# Altium project QUTMS_Shutdownboard_V2_1.PrjPcb (part 1 of 2)
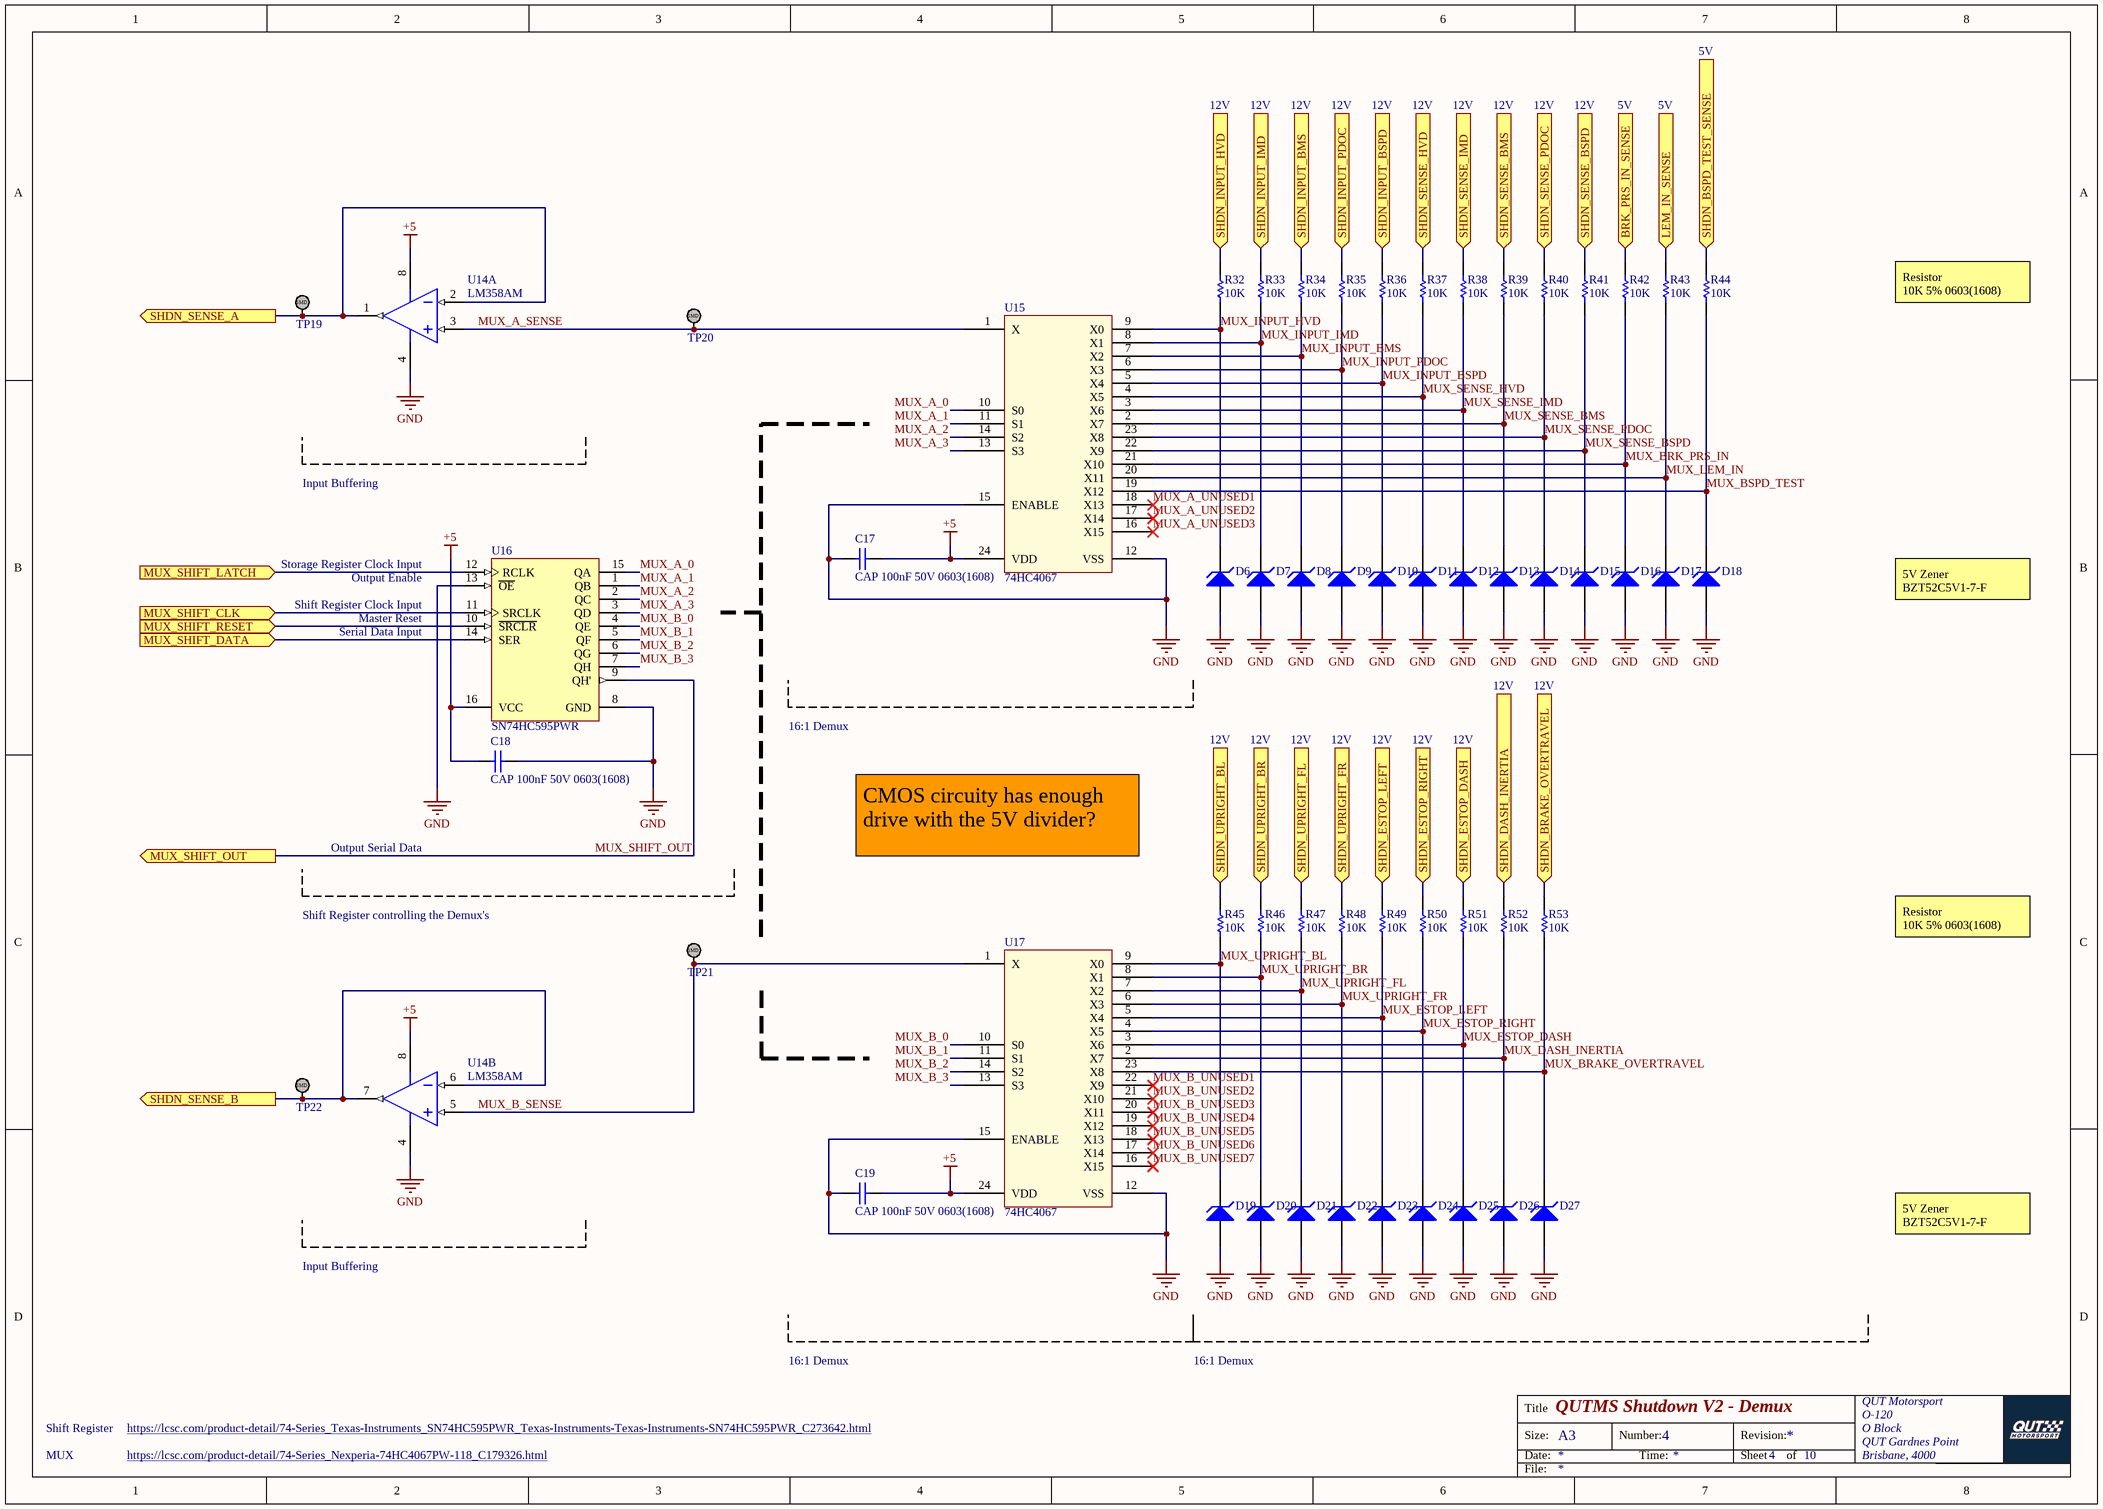
[diagram p0: Demux.SchDoc]
8 sheets, 180 parts. Net scope: hierarchical (ports join the sheet entries above them; power ports are global).
Sheets:
  Demux.SchDoc
  Master.SchDoc
    Connector = Connector.SchDoc
    SHDN_LOOP = ShutdownLoop.SchDoc
      SHDN_SEG1 = ShutdownSegement.SchDoc
      SHDN_SEG2 = ShutdownSegement.SchDoc
      SHDN_SEG3 = ShutdownSegement.SchDoc
      SHDN_SEG4 = ShutdownSegement.SchDoc
      SHDN_SEG5 = ShutdownSegement.SchDoc
      SHDN_SEG6 = ShutdownSegement.SchDoc
    MCU = MCU.SchDoc
    PWR = Power.SchDoc
    SHDN_RESET_PROTECTION = 12VInputProtection.SchDoc
    SHDN_RESET_PROTECTION = 12VInputProtection.SchDoc
    SHDN_RESET_PROTECTION = 12VInputProtection.SchDoc
    SHDN_RESET_PROTECTION = 12VInputProtection.SchDoc
    SHDN_RESET_PROTECTION = 12VInputProtection.SchDoc
    SHDN_RESET_PROTECTION = 12VInputProtection.SchDoc

## Sheet Demux.SchDoc: QUTMS Shutdown V2 - Demux
size A3; Organization: QUT Motorsport; Address1: O-120; Address2: O Block; Address3: QUT Gardnes Point; Address4: Brisbane, 4000; DocumentNumber: 4; SheetNumber: 4; SheetTotal: 10

### Parts
C17  CAP 100nF 50V 0603(1608)  [CAPC0603(1608)100_L]
C18  CAP 100nF 50V 0603(1608)  [CAPC0603(1608)100_L]
C19  CAP 100nF 50V 0603(1608)  [CAPC0603(1608)100_L]
D6  BZT52C5V1-7-F  [DIOD-SOD123_V]  (value not drawn)
D7  BZT52C5V1-7-F  [DIOD-SOD123_V]  (value not drawn)
D8  BZT52C5V1-7-F  [DIOD-SOD123_V]  (value not drawn)
D9  BZT52C5V1-7-F  [DIOD-SOD123_V]  (value not drawn)
D10  BZT52C5V1-7-F  [DIOD-SOD123_V]  (value not drawn)
D11  BZT52C5V1-7-F  [DIOD-SOD123_V]  (value not drawn)
D12  BZT52C5V1-7-F  [DIOD-SOD123_V]  (value not drawn)
D13  BZT52C5V1-7-F  [DIOD-SOD123_V]  (value not drawn)
D14  BZT52C5V1-7-F  [DIOD-SOD123_V]  (value not drawn)
D15  BZT52C5V1-7-F  [DIOD-SOD123_V]  (value not drawn)
D16  BZT52C5V1-7-F  [DIOD-SOD123_V]  (value not drawn)
D17  BZT52C5V1-7-F  [DIOD-SOD123_V]  (value not drawn)
D18  BZT52C5V1-7-F  [DIOD-SOD123_V]  (value not drawn)
D19  BZT52C5V1-7-F  [DIOD-SOD123_V]  (value not drawn)
D20  BZT52C5V1-7-F  [DIOD-SOD123_V]  (value not drawn)
D21  BZT52C5V1-7-F  [DIOD-SOD123_V]  (value not drawn)
D22  BZT52C5V1-7-F  [DIOD-SOD123_V]  (value not drawn)
D23  BZT52C5V1-7-F  [DIOD-SOD123_V]  (value not drawn)
D24  BZT52C5V1-7-F  [DIOD-SOD123_V]  (value not drawn)
D25  BZT52C5V1-7-F  [DIOD-SOD123_V]  (value not drawn)
D26  BZT52C5V1-7-F  [DIOD-SOD123_V]  (value not drawn)
D27  BZT52C5V1-7-F  [DIOD-SOD123_V]  (value not drawn)
R32  10K  [RESC0603(1608)_N]
R33  10K  [RESC0603(1608)_N]
R34  10K  [RESC0603(1608)_N]
R35  10K  [RESC0603(1608)_N]
R36  10K  [RESC0603(1608)_N]
R37  10K  [RESC0603(1608)_N]
R38  10K  [RESC0603(1608)_N]
R39  10K  [RESC0603(1608)_N]
R40  10K  [RESC0603(1608)_N]
R41  10K  [RESC0603(1608)_N]
R42  10K  [RESC0603(1608)_N]
R43  10K  [RESC0603(1608)_N]
R44  10K  [RESC0603(1608)_N]
R45  10K  [RESC0603(1608)_N]
R46  10K  [RESC0603(1608)_N]
R47  10K  [RESC0603(1608)_N]
R48  10K  [RESC0603(1608)_N]
R49  10K  [RESC0603(1608)_N]
R50  10K  [RESC0603(1608)_N]
R51  10K  [RESC0603(1608)_N]
R52  10K  [RESC0603(1608)_N]
R53  10K  [RESC0603(1608)_N]
TP19  TestPoint_SMD  [TestPointSMD]  (value not drawn)
TP20  TestPoint_SMD  [TestPointSMD]  (value not drawn)
TP21  TestPoint_SMD  [TestPointSMD]  (value not drawn)
TP22  TestPoint_SMD  [TestPointSMD]  (value not drawn)
U14  LM358AM  [D0008A_M]  (parts A,B of 2)
U15  74HC4067  [74HC4067 TSSOP24]
U16  SN74HC595PWR  [PW0016A_L]
U17  74HC4067  [74HC4067 TSSOP24]

### Ports
BRK_PRS_IN_SENSE (in), LEM_IN_SENSE (in), MUX_SHIFT_CLK (in), MUX_SHIFT_DATA (in), MUX_SHIFT_LATCH (in), MUX_SHIFT_OUT (out), MUX_SHIFT_RESET (in), SHDN_BRAKE_OVERTRAVEL (in), SHDN_BSPD_TEST_SENSE (in), SHDN_DASH_INERTIA (in), SHDN_ESTOP_DASH (in), SHDN_ESTOP_LEFT (in), SHDN_ESTOP_RIGHT (in), SHDN_INPUT_BMS (in), SHDN_INPUT_BSPD (in), SHDN_INPUT_HVD (in), SHDN_INPUT_IMD (in), SHDN_INPUT_PDOC (in), SHDN_SENSE_A (out), SHDN_SENSE_B (out), SHDN_SENSE_BMS (in), SHDN_SENSE_BSPD (in), SHDN_SENSE_HVD (in), SHDN_SENSE_IMD (in), SHDN_SENSE_PDOC (in), SHDN_UPRIGHT_BL (in), SHDN_UPRIGHT_BR (in), SHDN_UPRIGHT_FL (in), SHDN_UPRIGHT_FR (in)

### Nets
+5: C17.1 C18.2 C19.1 U14.8(V+) U15.24(VDD) U16.16(VCC) U17.24(VDD)
GND: C17.2 C18.1 C19.2 D6.1(A) D7.1(A) D8.1(A) D9.1(A) D10.1(A) D11.1(A) D12.1(A) D13.1(A) D14.1(A) D15.1(A) D16.1(A) D17.1(A) D18.1(A) D19.1(A) D20.1(A) D21.1(A) D22.1(A) D23.1(A) D24.1(A) D25.1(A) D26.1(A) D27.1(A) U14.4(GND) U15.12(VSS) U15.15(ENABLE) U16.8(GND) U16.13(~{OE}) U17.12(VSS) U17.15(ENABLE)
MUX_A_0: U15.10(S0) U16.15(QA)
MUX_A_1: U15.11(S1) U16.1(QB)
MUX_A_2: U15.14(S2) U16.2(QC)
MUX_A_3: U15.13(S3) U16.3(QD)
MUX_A_SENSE: TP20.1 U14.3(INA+) U15.1(X)
MUX_A_UNUSED1: U15.18(X13)
MUX_A_UNUSED2: U15.17(X14)
MUX_A_UNUSED3: U15.16(X15)
MUX_B_0: U16.4(QE) U17.10(S0)
MUX_B_1: U16.5(QF) U17.11(S1)
MUX_B_2: U16.6(QG) U17.14(S2)
MUX_B_3: U16.7(QH) U17.13(S3)
MUX_B_SENSE: TP21.1 U14.5(INB+) U17.1(X)
MUX_B_UNUSED1: U17.22(X9)
MUX_B_UNUSED2: U17.21(X10)
MUX_B_UNUSED3: U17.20(X11)
MUX_B_UNUSED4: U17.19(X12)
MUX_B_UNUSED5: U17.18(X13)
MUX_B_UNUSED6: U17.17(X14)
MUX_B_UNUSED7: U17.16(X15)
MUX_BRAKE_OVERTRAVEL: D27.2(K) R53.2 U17.23(X8)
MUX_BRK_PRS_IN: D16.2(K) R42.2 U15.21(X10)
MUX_BSPD_TEST: D18.2(K) R44.2 U15.19(X12)
MUX_DASH_INERTIA: D26.2(K) R52.2 U17.2(X7)
MUX_ESTOP_DASH: D25.2(K) R51.2 U17.3(X6)
MUX_ESTOP_LEFT: D23.2(K) R49.2 U17.5(X4)
MUX_ESTOP_RIGHT: D24.2(K) R50.2 U17.4(X5)
MUX_INPUT_BMS: D8.2(K) R34.2 U15.7(X2)
MUX_INPUT_BSPD: D10.2(K) R36.2 U15.5(X4)
MUX_INPUT_HVD: D6.2(K) R32.2 U15.9(X0)
MUX_INPUT_IMD: D7.2(K) R33.2 U15.8(X1)
MUX_INPUT_PDOC: D9.2(K) R35.2 U15.6(X3)
MUX_LEM_IN: D17.2(K) R43.2 U15.20(X11)
MUX_SENSE_BMS: D13.2(K) R39.2 U15.2(X7)
MUX_SENSE_BSPD: D15.2(K) R41.2 U15.22(X9)
MUX_SENSE_HVD: D11.2(K) R37.2 U15.4(X5)
MUX_SENSE_IMD: D12.2(K) R38.2 U15.3(X6)
MUX_SENSE_PDOC: D14.2(K) R40.2 U15.23(X8)
MUX_SHIFT_OUT: U16.9(QH') ; port MUX_SHIFT_OUT
MUX_UPRIGHT_BL: D19.2(K) R45.2 U17.9(X0)
MUX_UPRIGHT_BR: D20.2(K) R46.2 U17.8(X1)
MUX_UPRIGHT_FL: D21.2(K) R47.2 U17.7(X2)
MUX_UPRIGHT_FR: D22.2(K) R48.2 U17.6(X3)
NetR32_1: R32.1 ; port SHDN_INPUT_HVD
NetR33_1: R33.1 ; port SHDN_INPUT_IMD
NetR34_1: R34.1 ; port SHDN_INPUT_BMS
NetR35_1: R35.1 ; port SHDN_INPUT_PDOC
NetR36_1: R36.1 ; port SHDN_INPUT_BSPD
NetR37_1: R37.1 ; port SHDN_SENSE_HVD
NetR38_1: R38.1 ; port SHDN_SENSE_IMD
NetR39_1: R39.1 ; port SHDN_SENSE_BMS
NetR40_1: R40.1 ; port SHDN_SENSE_PDOC
NetR41_1: R41.1 ; port SHDN_SENSE_BSPD
NetR42_1: R42.1 ; port BRK_PRS_IN_SENSE
NetR43_1: R43.1 ; port LEM_IN_SENSE
NetR44_1: R44.1 ; port SHDN_BSPD_TEST_SENSE
NetR45_1: R45.1 ; port SHDN_UPRIGHT_BL
NetR46_1: R46.1 ; port SHDN_UPRIGHT_BR
NetR47_1: R47.1 ; port SHDN_UPRIGHT_FL
NetR48_1: R48.1 ; port SHDN_UPRIGHT_FR
NetR49_1: R49.1 ; port SHDN_ESTOP_LEFT
NetR50_1: R50.1 ; port SHDN_ESTOP_RIGHT
NetR51_1: R51.1 ; port SHDN_ESTOP_DASH
NetR52_1: R52.1 ; port SHDN_DASH_INERTIA
NetR53_1: R53.1 ; port SHDN_BRAKE_OVERTRAVEL
NetTP19_1: TP19.1 U14.1(OUTA) U14.2(INA-) ; port SHDN_SENSE_A
NetTP22_1: TP22.1 U14.6(INB-) U14.7(OUTB) ; port SHDN_SENSE_B
NetU16_10: U16.10(~{SRCLR}) ; port MUX_SHIFT_RESET
NetU16_11: U16.11(SRCLK) ; port MUX_SHIFT_CLK
NetU16_12: U16.12(RCLK) ; port MUX_SHIFT_LATCH
NetU16_14: U16.14(SER) ; port MUX_SHIFT_DATA

### Notes on the sheet
- 12V
- 5V
- Resistor
  10K 5% 0603(1608)
- Input Buffering
- Output Enable
- Storage Register Clock Input
- Serial Data Input
- Master Reset
- Shift Register Clock Input
- 5V Zener
  BZT52C5V1-7-F
- 16:1 Demux
- Output Serial Data
- CMOS circuity has enough drive with the 5V divider?
- Shift Register controlling the Demux's
- MUX
- Shift Register
- https://lcsc.com/product-detail/74-Series_Nexperia-74HC4067PW-118_C179326.html
- https://lcsc.com/product-detail/74-Series_Texas-Instruments_SN74HC595PWR_Texas-Instruments-Texas-Instruments-SN74HC595PWR_C273642.html
- Title
- Size:
- Date:
- A3
- Number:
- Time:
- Revision:
- Sheet
- of
- File:
- (in symbol TestPoint_SMD) SMD

### Library data of the parts
C17-C19 = CMP-1035-02591-1: CAP 100nF 50V ±5% 0603 (1608 Metric) Thickness 1mm SMD; Tolerance: Â±5%; Case-Metric: 1608; Case-EIA: 0603; Rated Voltage: 50 V; Max Thickness: 1 mm; Technology: SMT; Value: 100nF
D6-D27 = CMP-2000-05976-1: Surface Mount Zener Diode, 5.1 V, -65 to 150 degC, 2-Pin SMD (SOD-123), RoHS, Tape and Reel; Manufacturer: DiodesIncorporated; Unit Weight: 0.000353oz; Zz - Zener Impedance: 60Ohms; Vz - Zener Voltage: 5.1V; Pd - Power Dissipation: 500mW; Zener Current: 5mA; Ir - Reverse Current: 2uA; Voltage Temperature Coefficient: -0.75mV/C; Configuration: Single; Voltage Tolerance: 6%; Height: 1.35mm; Width: 1.7mm; Minimum Operating Temperature: -65C; Series: BZT52C5; Package Description: 2-Pin Surface Mount Device, Body 2.7 x 1.55 mm; Length: 2.85mm; Mounting Technology: SurfaceMount; Brand: DiodesIncorporated; Factory Pack Quantity: 3000; Product Category: ZenerDiodes; RoHS: True; Manufacturer URL: http://www.diodes.com/; Termination Style: SMD/SMT; Package / Case: SOD-123; Packaging: Reel; Package Reference: SOD123; Datasheet Version: Rev. 37-2, 09/2012; Maximum Operating Temperature: +150C; Datasheet URL: http://www.diodes.com/_files/datasheets/ds18004.pdf; Mounting Style: SMD/SMT
R32-R53 = CMP-1012-00098-1: 10K 0.1W 5% 0603 (1608 Metric)  SMD; Case-EIA: 0603; Value: 10000.00 Ohm; Case-Metric: 1608; Technology: SMT; Tolerance: 5 %; Power: 0.1 W
U14 = CMP-0055-00796-3: Low Power Dual Operational Amplifier, 8-pin Narrow SOIC; Manufacturer: Texas Instruments; CompType: Amplifiers; PackageTopMarking: NSZXTT*LM*358AM; PowerWise: N; Code_JEDEC: MS-012-AA; RoHS: N; PinCount: 8; Package Reference: D0008A; ComponentLink1Description: Datasheet URL; ComponentLink1URL: http://www.ti.com/general/docs/lit/getliterature.tsp?genericPartNumber=LM358-N&fileType=pdf; Code_IPC: SOIC127P600-8; PackageDescription: SOIC Narrow, 4.9 x 3.9 x 1.45mm, 8 Lead, 1.27mm Pitch
U16 = CMP-0780-00192-3: 8-Bit Shift Registers With 3-State Output Registers, PW0016A, LARGE T&R; Manufacturer: Texas Instruments; VCC(Max)(V): 6; Bits: 8; Output Type: CMOS; 3-State Output: Yes; Output Drive (IOL/IOH)(Max)(mA): 7.8/-7.8; VCC(Min)(V): 2; Rating: Military; tpd @ Nom Voltage(Max)(ns): 34; ICC @ Nom Voltage(Max)(mA): 0.08; Technology Family: HC; F @ Nom Voltage(Max)(Mhz): 28; PackageReference: PW0016A; Generic Part Number: SN74HC595; Operating Temperature Range(C): -40 to 85; PackageVersion: http://www.ti.com/lit/ml/mpds361/mpds361.pdf; Code_JEDEC: MO-153; DatasheetVersion: SCLS041H; Voltage(Nom)(V): 6; Input Type: CMOS

## Sheet Master.SchDoc
size A3
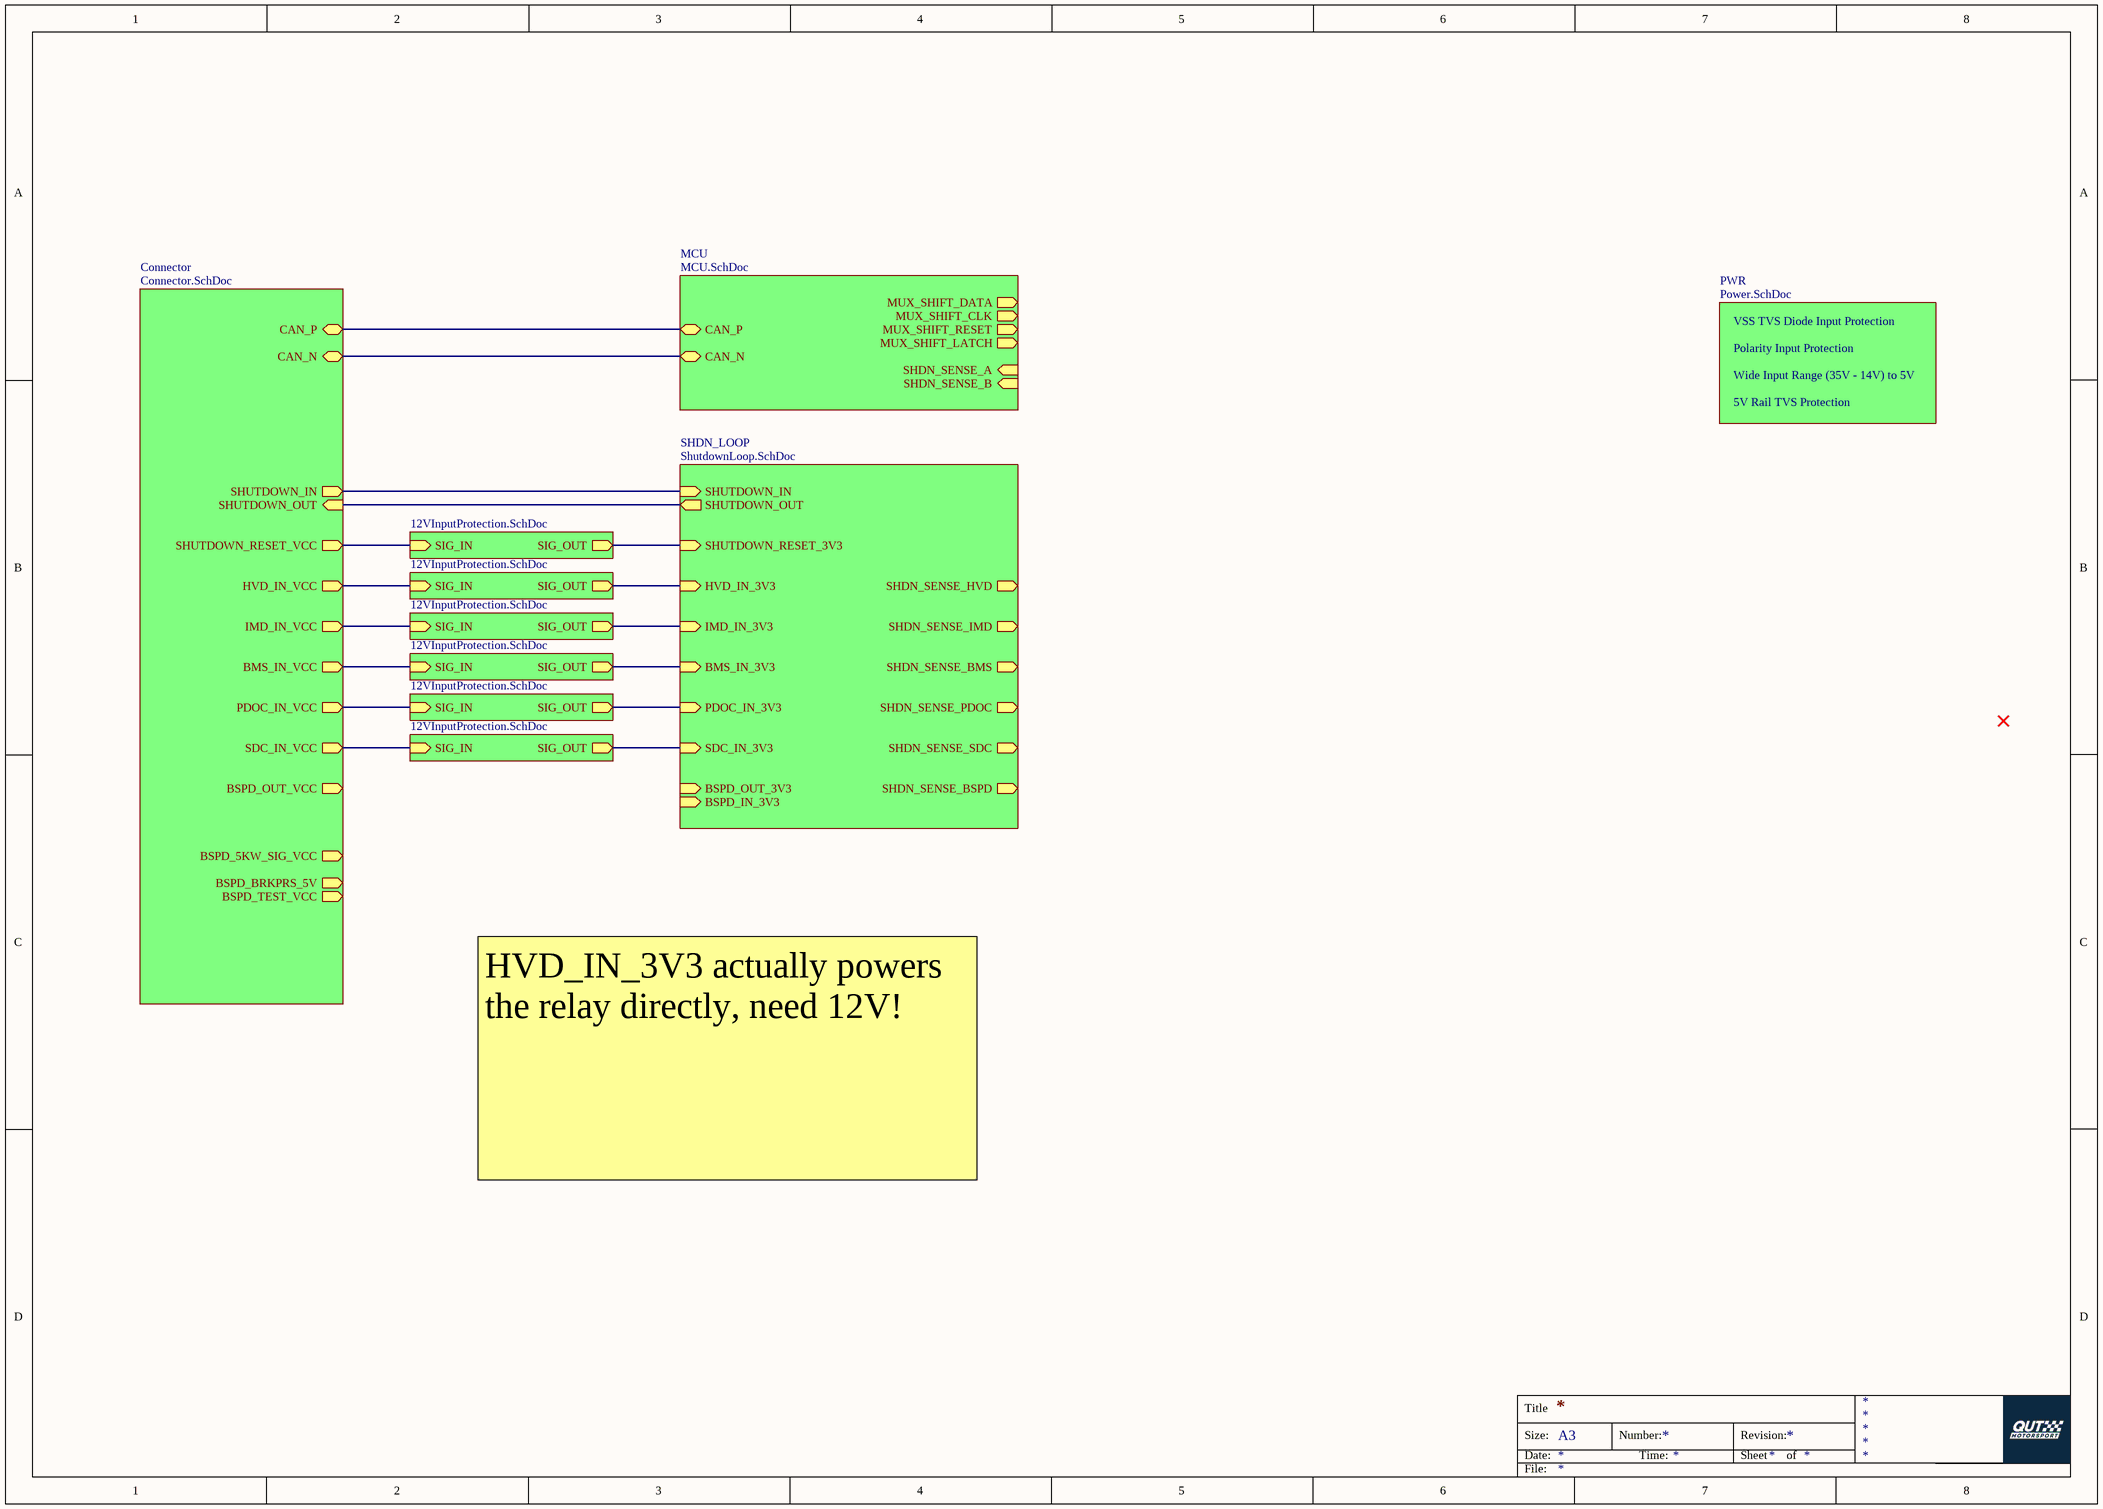
[diagram p1: Master.SchDoc]

### Sub-sheets
Connector = Connector.SchDoc: CAN_N (bidir), CAN_P (bidir), SHUTDOWN_IN (out), SHUTDOWN_OUT (in), HVD_IN_VCC (out), BMS_IN_VCC (out), SHUTDOWN_RESET_VCC (out), SDC_IN_VCC (out), BSPD_OUT_VCC (out), BSPD_BRKPRS_5V (out), PDOC_IN_VCC (out), BSPD_TEST_VCC (out), IMD_IN_VCC (out), BSPD_5KW_SIG_VCC (out)
MCU = MCU.SchDoc: SHDN_SENSE_B (in), SHDN_SENSE_A (in), MUX_SHIFT_LATCH (out), MUX_SHIFT_RESET (out), MUX_SHIFT_CLK (out), MUX_SHIFT_DATA (out), CAN_P (bidir), CAN_N (bidir)
PWR = Power.SchDoc: no entries
SHDN_LOOP = ShutdownLoop.SchDoc: SHDN_SENSE_BSPD (out), SHDN_SENSE_PDOC (out), SHDN_SENSE_BMS (out), SHDN_SENSE_IMD (out), SHUTDOWN_OUT (out), SHUTDOWN_IN (in), SHDN_SENSE_HVD (out), SHDN_SENSE_SDC (out), BSPD_IN_3V3 (in), SDC_IN_3V3 (in), SHUTDOWN_RESET_3V3 (in), BMS_IN_3V3 (in), IMD_IN_3V3 (in), PDOC_IN_3V3 (in), HVD_IN_3V3 (in), BSPD_OUT_3V3 (in)
SHDN_RESET_PROTECTION = 12VInputProtection.SchDoc: SIG_OUT (out), SIG_IN (in)
SHDN_RESET_PROTECTION = 12VInputProtection.SchDoc: SIG_OUT (out), SIG_IN (in)
SHDN_RESET_PROTECTION = 12VInputProtection.SchDoc: SIG_OUT (out), SIG_IN (in)
SHDN_RESET_PROTECTION = 12VInputProtection.SchDoc: SIG_OUT (out), SIG_IN (in)
SHDN_RESET_PROTECTION = 12VInputProtection.SchDoc: SIG_OUT (out), SIG_IN (in)
SHDN_RESET_PROTECTION = 12VInputProtection.SchDoc: SIG_OUT (out), SIG_IN (in)

### Nets
BMS_IN_VCC: sheet Connector/BMS_IN_VCC, sheet SHDN_RESET_PROTECTION/SIG_IN
CAN_N: sheet Connector/CAN_N, sheet MCU/CAN_N
CAN_P: sheet Connector/CAN_P, sheet MCU/CAN_P
HVD_IN_VCC: sheet Connector/HVD_IN_VCC, sheet SHDN_RESET_PROTECTION/SIG_IN
IMD_IN_VCC: sheet Connector/IMD_IN_VCC, sheet SHDN_RESET_PROTECTION/SIG_IN
PDOC_IN_VCC: sheet Connector/PDOC_IN_VCC, sheet SHDN_RESET_PROTECTION/SIG_IN
SDC_IN_VCC: sheet Connector/SDC_IN_VCC, sheet SHDN_RESET_PROTECTION/SIG_IN
SHDN_IN1: sheet Connector/SHUTDOWN_IN, sheet SHDN_LOOP/SHUTDOWN_IN
SHDN_OUT6: sheet Connector/SHUTDOWN_OUT, sheet SHDN_LOOP/SHUTDOWN_OUT
SHDN_SEG_LATCH: sheet SHDN_LOOP/SHUTDOWN_RESET_3V3, sheet SHDN_RESET_PROTECTION/SIG_OUT
SHUTDOWN_RESET: sheet Connector/SHUTDOWN_RESET_VCC, sheet SHDN_RESET_PROTECTION/SIG_IN
STATE_TRIGGER1: sheet SHDN_LOOP/HVD_IN_3V3, sheet SHDN_RESET_PROTECTION/SIG_OUT
STATE_TRIGGER2: sheet SHDN_LOOP/IMD_IN_3V3, sheet SHDN_RESET_PROTECTION/SIG_OUT
STATE_TRIGGER3: sheet SHDN_LOOP/BMS_IN_3V3, sheet SHDN_RESET_PROTECTION/SIG_OUT
STATE_TRIGGER4: sheet SHDN_LOOP/PDOC_IN_3V3, sheet SHDN_RESET_PROTECTION/SIG_OUT
STATE_TRIGGER6: sheet SHDN_LOOP/SDC_IN_3V3, sheet SHDN_RESET_PROTECTION/SIG_OUT

### Notes on the sheet
- VSS TVS Diode Input Protection
- Polarity Input Protection
- Wide Input Range (35V - 14V) to 5V
- 5V Rail TVS Protection
- HVD_IN_3V3 actually powers the relay directly, need 12V!
- Title
- Size:
- Date:
- A3
- Number:
- Time:
- Revision:
- Sheet
- of
- File:

## Sheet Connector.SchDoc: QUTMS Shutdown V2 - Connector
size A4; Organization: QUT Motorsport; Address1: O-120; Address2: O Block; Address3: QUT Gardens Point; Address4: Brisbane, 4000; DocumentNumber: 3; SheetNumber: 3; SheetTotal: 10
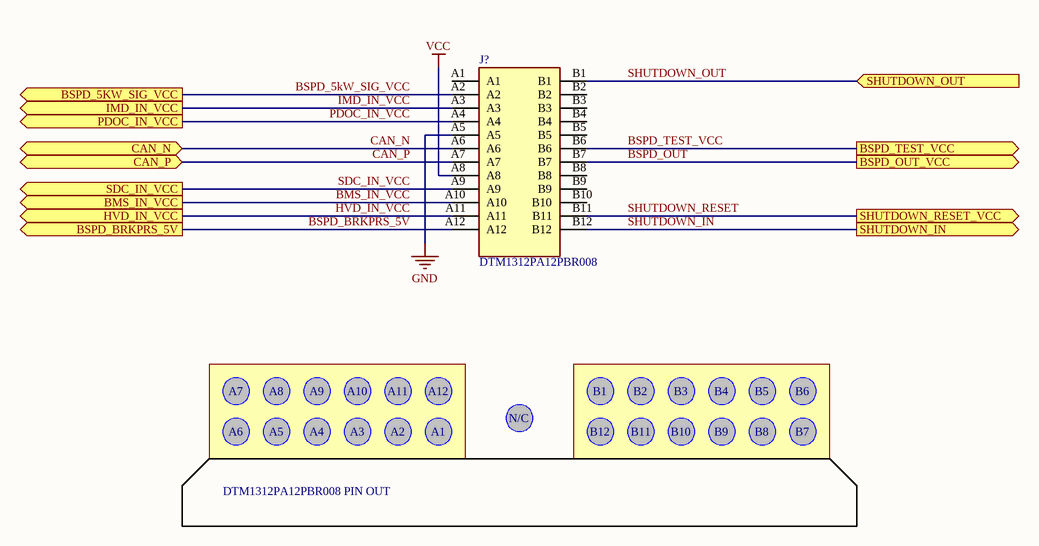
[diagram p2: Connector.SchDoc]

### Parts
J?  DTM1312PA12PBR008  [TE_DTM1312PA12PBR008]

### Ports
BMS_IN_VCC (out), BSPD_5KW_SIG_VCC (out), BSPD_BRKPRS_5V (out), BSPD_OUT_VCC (out), BSPD_TEST_VCC (out), CAN_N (bidir), CAN_P (bidir), HVD_IN_VCC (out), IMD_IN_VCC (out), PDOC_IN_VCC (out), SDC_IN_VCC (out), SHUTDOWN_IN (out), SHUTDOWN_OUT (in), SHUTDOWN_RESET_VCC (out)

### Nets
GND: J?.A5
VCC: J?.A8
BMS_IN_VCC: J?.A10 ; port BMS_IN_VCC
BSPD_5kW_SIG_VCC: J?.A2 ; port BSPD_5KW_SIG_VCC
BSPD_BRKPRS_5V: J?.A12 ; port BSPD_BRKPRS_5V
BSPD_OUT: J?.B7 ; port BSPD_OUT_VCC
BSPD_TEST_VCC: J?.B6 ; port BSPD_TEST_VCC
CAN_N: J?.A6 ; port CAN_N
CAN_P: J?.A7 ; port CAN_P
HVD_IN_VCC: J?.A11 ; port HVD_IN_VCC
IMD_IN_VCC: J?.A3 ; port IMD_IN_VCC
PDOC_IN_VCC: J?.A4 ; port PDOC_IN_VCC
SDC_IN_VCC: J?.A9 ; port SDC_IN_VCC
SHUTDOWN_IN: J?.B12 ; port SHUTDOWN_IN  [project net SHDN_IN1]
SHUTDOWN_OUT: J?.B1 ; port SHUTDOWN_OUT  [project net SHDN_OUT6]
SHUTDOWN_RESET: J?.B11 ; port SHUTDOWN_RESET_VCC

Not connected (* = marked no-connect by the designer): J? A1 B2 B3 B4 B5 B8 B9 B10

### Notes on the sheet
- A7
- A8
- A9
- A10
- A11
- A12
- N/C
- B1
- B2
- B3
- B4
- B5
- B6
- A6
- A5
- A4
- A3
- A2
- A1
- B12
- B11
- B10
- B9
- B8
- B7
- DTM1312PA12PBR008 PIN OUT
- Title
- Size:
- Date:
- Number:
- Time:
- Revision:
- Sheet
- of
- File:

### Library data of the parts
J? = DTM1312PA12PBR008: 24 way sealed A and B key PCB header with .165 inch/4.2 millimeter centerline pitch.; MP: DTM13-12PA-12PB-R008; MF: TE Connectivity; Digi-Key_Part_Number: 1734-1131-ND; Digi-Key_Purchase_URL: https://www.digikey.com/product-detail/en/te-connectivity-deutsch-connectors/DTM13-12PA-12PB-R008/1734-1131-ND/6566695?utm_source=snapeda&utm_medium=aggregator&utm_campaign=symbol; Package: None; Value: *; TE_purchase_URL: https://www.te.com/usa-en/product-DTM1312PA12PBR008.html?te_bu=Cor&te_type=disp&te_campaign=seda_glo_cor-seda-global-disp-prtnr-fy19-seda-model-bom-cta_sma-317_1&elqCampaignId=32493; SnapEDA_Link: https://www.snapeda.com/parts/DTM13-12PA-12PB-R008/TE%20Connectivity%20Deutsch%20Connectors/view-part/490507/?ref=snap

## Sheet ShutdownLoop.SchDoc: QUTMS Shutdown V2 - ShutdownLoop
size A4; Organization: QUT Motorsport; Address1: O-120; Address2: O Block; Address3: QUT Gardnes Point; Address4: Brisbane, 4000; DocumentNumber: 2; SheetNumber: 2; SheetTotal: 10
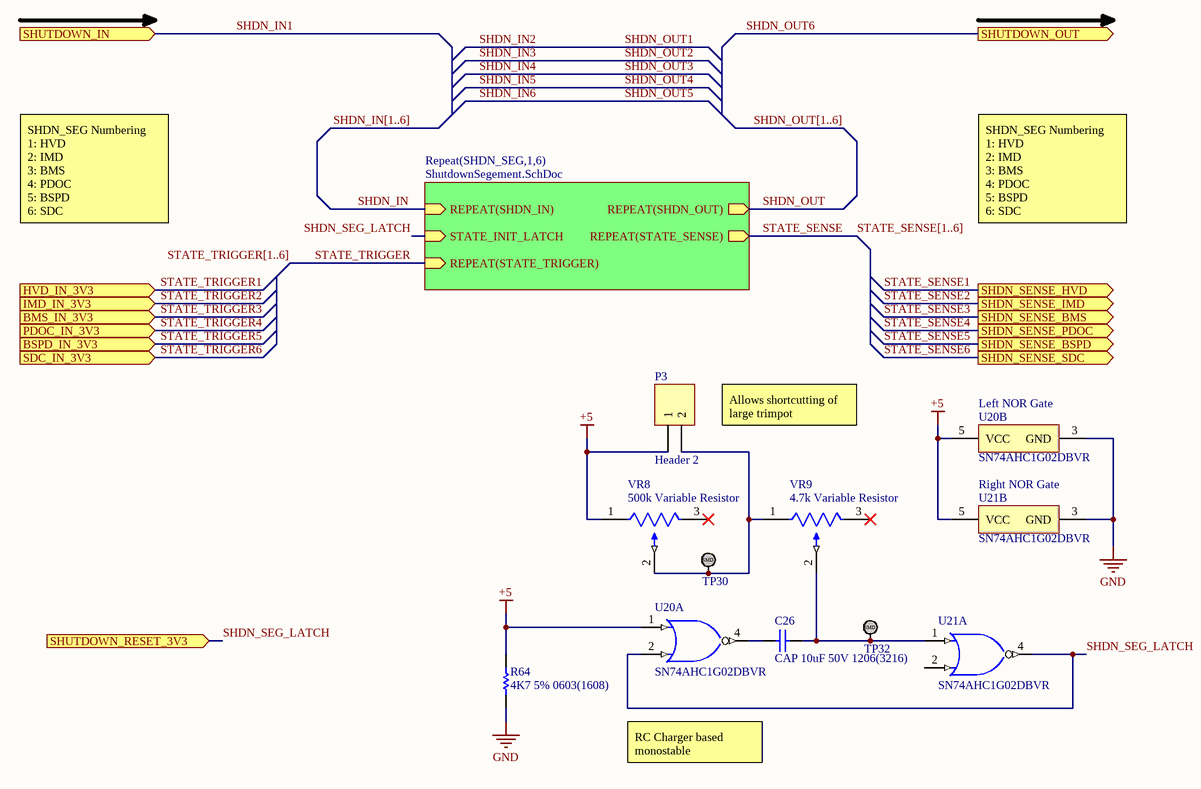
[diagram p3: ShutdownLoop.SchDoc]

### Parts
C26  CAP 10uF 50V 1206(3216)  [CAPC1206(3216)190_M]
P3  Header 2  [HDR1X2]
R64  4K7 5% 0603(1608)  [RESC0603(1608)_N]
TP30  TestPoint_SMD  [TestPointSMD]  (value not drawn)
TP32  TestPoint_SMD  [TestPointSMD]  (value not drawn)
U20  SN74AHC1G02DBVR  [DBV0005A_L]  (parts A,B of 2)
U21  SN74AHC1G02DBVR  [DBV0005A_L]  (parts A,B of 2)
VR8  500k Variable Resistor  [VG039NCHXTB472]
VR9  4.7k Variable Resistor  [VG039NCHXTB472]

### Sub-sheets
Repeat(SHDN_SEG,1,6) = ShutdownSegement.SchDoc: REPEAT(SHDN_OUT) (out), REPEAT(SHDN_IN) (in), STATE_INIT_LATCH (in), REPEAT(STATE_TRIGGER) (in), REPEAT(STATE_SENSE) (out)

### Ports
BMS_IN_3V3 (in), BSPD_IN_3V3 (in), HVD_IN_3V3 (in), IMD_IN_3V3 (in), PDOC_IN_3V3 (in), SDC_IN_3V3 (in), SHDN_SENSE_BMS (out), SHDN_SENSE_BSPD (out), SHDN_SENSE_HVD (out), SHDN_SENSE_IMD (out), SHDN_SENSE_PDOC (out), SHDN_SENSE_SDC (out), SHUTDOWN_IN (in), SHUTDOWN_OUT (out), SHUTDOWN_RESET_3V3 (in)

### Nets
+5: P3.1 R64.2 U20.1(A) U20.5(VCC) U21.5(VCC) VR8.1
GND: R64.1 U20.3(GND) U21.3(GND)
SHDN_IN: sheet Repeat(SHDN_SEG,1,6)/REPEAT(SHDN_IN)
SHDN_OUT: sheet Repeat(SHDN_SEG,1,6)/REPEAT(SHDN_OUT)
SHDN_SEG_LATCH: U20.2(B) U21.4(Y) ; port SHUTDOWN_RESET_3V3, sheet Repeat(SHDN_SEG,1,6)/STATE_INIT_LATCH
STATE_SENSE: sheet Repeat(SHDN_SEG,1,6)/REPEAT(STATE_SENSE)
STATE_TRIGGER: sheet Repeat(SHDN_SEG,1,6)/REPEAT(STATE_TRIGGER)
NetC26_1: C26.1 TP32.1 U21.1(A) VR9.2
NetC26_2: C26.2 U20.4(Y)
NetP3_2: P3.2 TP30.1 VR8.2 VR9.1

Not connected (* = marked no-connect by the designer): U21 2(B); VR8 3(49)*; VR9 3(49)*

### Buses and harness runs
bus SHDN_IN[1..6]
bus SHDN_OUT[1..6]
bus STATE_SENSE[1..6]
bus STATE_TRIGGER[1..6]

### Notes on the sheet
- SHDN_SEG Numbering
  1: HVD
  2: IMD
  3: BMS
  4: PDOC
  5: BSPD
  6: SDC
- (near U20) Left NOR Gate
- (near P3) Allows shortcutting of large trimpot
- Right NOR Gate
- RC Charger based monostable
- Title
- Size:
- Date:
- A4
- Number:
- Time:
- Revision:
- Sheet
- of
- File:
- (in symbol TestPoint_SMD) SMD

### Library data of the parts
C26 = CMP-1037-04982-1: CAP 10uF 50V ±10% 1206 (3216 Metric) Thickness 1.9mm SMD; Case-EIA: 1206; Tolerance: Â±10%; Case-Metric: 3216; Technology: SMT; Max Thickness: 1.9 mm; Value: 10uF; Rated Voltage: 50 V
P3 = Header 2: Header, 2-Pin; LatestRevisionDate: 17-Jul-2002; LatestRevisionNote: Re-released for DXP Platform.; Publisher: Altium Limited
R64 = CMP-1012-00090-1: 4K7 0.1W 5% 0603 (1608 Metric)  SMD; Case-Metric: 1608; Value: 4700.00 Ohm; Case-EIA: 0603; Tolerance: 5 %; Technology: SMT; Power: 0.1 W
U20 U21 = CMP-0859-00024-3: Single 2-Input Positive-NOR Gate, DBV0005A, LARGE T&R; Manufacturer: Texas Instruments; Output Drive (IOL/IOH)(Max)(mA): 50/-50; Sub-Family: NAND Gate; Gate Type: NOR; Output Type: CMOS; 3-State Output: No; Voltage(Nom)(V): 3.3,5; tpd @ Nom Voltage(Max)(ns): 11.4,7.5; Bits(#): 1; VCC(Max)(V): 5.5; ICC @ Nom Voltage(Max)(mA): 0.01; VCC(Min)(V): 2; Technology Family: AHC; Rating: Catalog; Logic: True; F @ Nom Voltage(Max)(Mhz): 75; DatasheetVersion: SCLS342M; Input Type: CMOS; Operating Temperature Range(C): -40 to 125,-40 to 85; Generic Part Number: SN74AHC1G02; PackageReference: DBV0005A; Schmitt Trigger: No
VR8 = 500k Variable Resistor: 500K ±25% ±250 ppm/°C SMD Variable Resistors RoHS | VG039NCHXTB504; ComponentLink1Description: LCSC; ComponentLink1URL: https://lcsc.com/product-detail/Variable-Resistors_HDK-Hokuriku-Elec-Industry-VG039NCHXTB504_C128558.html
VR9 = 4.7k Variable Resistor: 4k7 ±25% ±250 ppm/°C SMD Variable Resistors RoHS | VG039NCHXTB472; ComponentLink1Description: LCSC; ComponentLink1URL: https://lcsc.com/product-detail/Variable-Resistors_HDK-Hokuriku-Elec-Industry-VG039NCHXTB472_C128555.html

## Sheet ShutdownSegement.SchDoc: QUTMS_Shutdown_V2_1
size A4; DocumentNumber: 10; SheetNumber: 10; SheetTotal: 10
Used 6 times, as channels SHDN_LOOP/SHDN_SEG1, SHDN_LOOP/SHDN_SEG2, SHDN_LOOP/SHDN_SEG3, SHDN_LOOP/SHDN_SEG4, SHDN_LOOP/SHDN_SEG5, SHDN_LOOP/SHDN_SEG6. Parts and nets are listed once, with the designators drawn on the sheet.
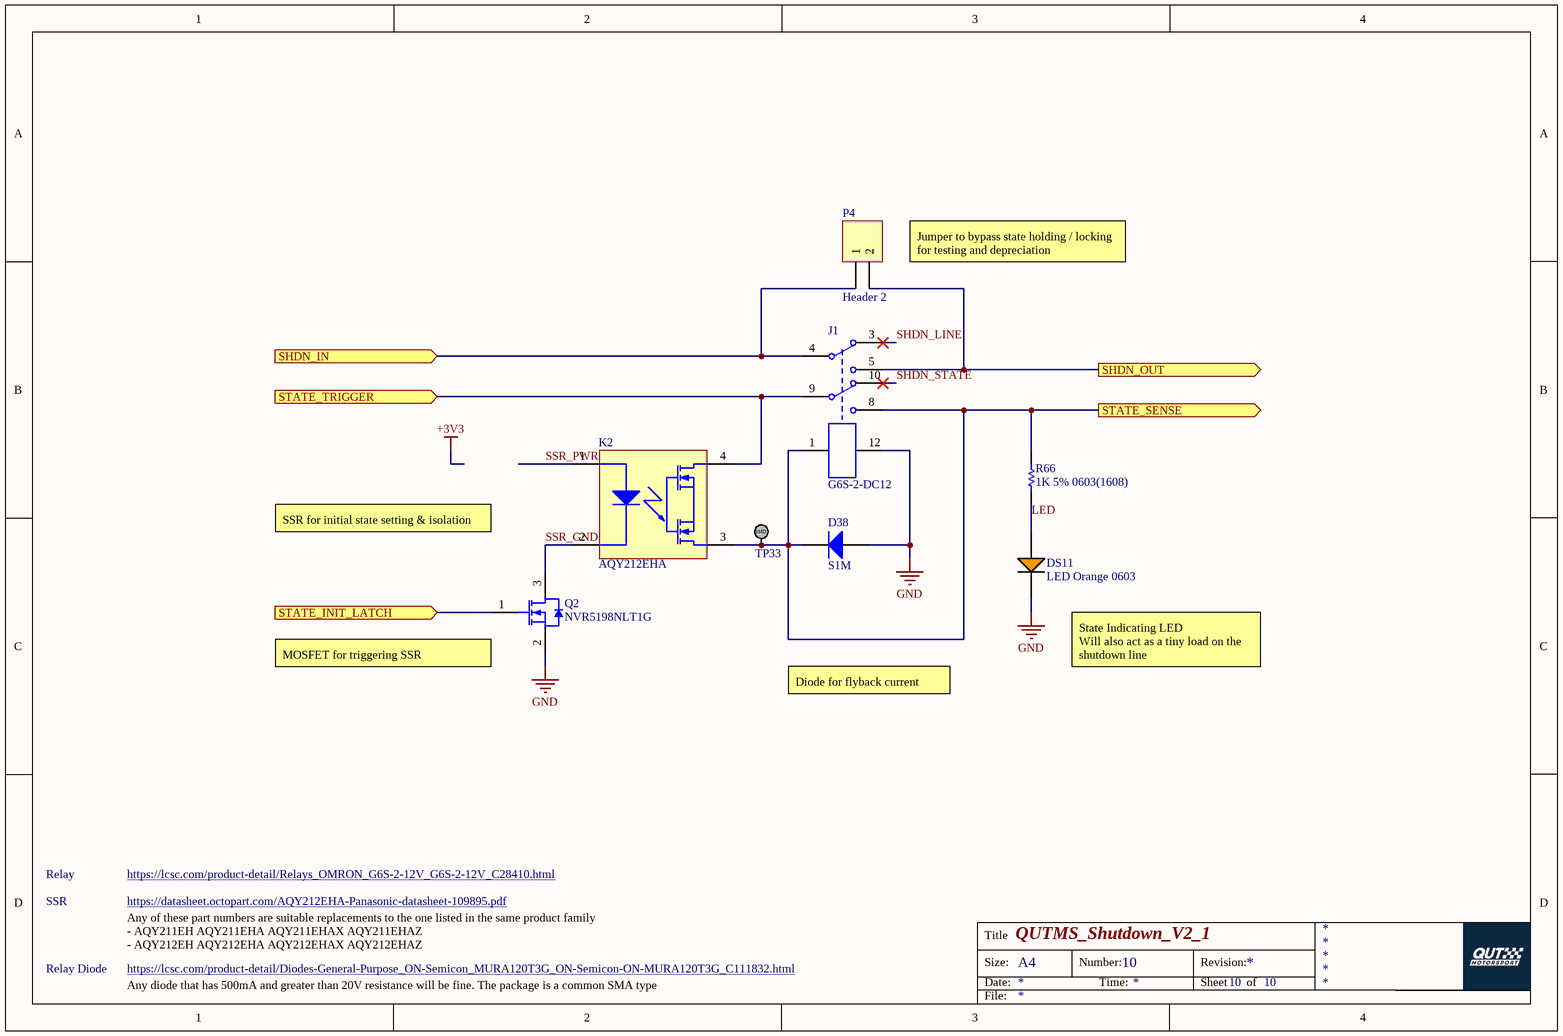
[diagram p4: ShutdownSegement.SchDoc]

### Parts
D38  S1M  [FAIR-DO-214AC-2_V]
DS11  LED Orange 0603  [LED ORANGE 0603]
J1  G6S-2-DC12  [G6S-2]
K2  AQY212EHA  [PNSC-DIP4(SMT)_V]
P4  Header 2  [HDR1X2]
Q2  NVR5198NLT1G  [ONSC-SOT-23-3-318-08_V]
R66  1K 5% 0603(1608)  [RESC0603(1608)_L]
TP33  TestPoint_SMD  [TestPointSMD]  (value not drawn)

### Ports
SHDN_IN (in), SHDN_OUT (out), STATE_INIT_LATCH (in), STATE_SENSE (out), STATE_TRIGGER (in)

### Nets
GND: D38.1(A) DS11.2(C) J1.12 Q2.2(S)
LED: DS11.1(A) R66.1
SHDN_IN: J1.4 P4.1 ; port SHDN_IN
SHDN_LINE: J1.3
SHDN_OUT: J1.5 P4.2 ; port SHDN_OUT
SHDN_STATE: J1.10
SSR_GND: K2.2 Q2.3(D)
SSR_PWR: K2.1
STATE_INIT_LATCH: Q2.1(G) ; port STATE_INIT_LATCH
STATE_SENSE: D38.2(K) J1.1 J1.8 K2.3 R66.2 TP33.1 ; port STATE_SENSE
STATE_TRIGGER: J1.9 K2.4 ; port STATE_TRIGGER

### Channels
SHDN_LOOP/SHDN_SEG1: designators end in _SHDN_SEG1; ports SHDN_IN=SHDN_IN1 SHDN_OUT=SHDN_IN2 STATE_INIT_LATCH=SHDN_SEG_LATCH STATE_SENSE=STATE_SENSE1 STATE_TRIGGER=STATE_TRIGGER1
SHDN_LOOP/SHDN_SEG2: designators end in _SHDN_SEG2; ports SHDN_IN=SHDN_IN2 SHDN_OUT=SHDN_IN3 STATE_INIT_LATCH=SHDN_SEG_LATCH STATE_SENSE=STATE_SENSE2 STATE_TRIGGER=STATE_TRIGGER2
SHDN_LOOP/SHDN_SEG3: designators end in _SHDN_SEG3; ports SHDN_IN=SHDN_IN3 SHDN_OUT=SHDN_IN4 STATE_INIT_LATCH=SHDN_SEG_LATCH STATE_SENSE=STATE_SENSE3 STATE_TRIGGER=STATE_TRIGGER3
SHDN_LOOP/SHDN_SEG4: designators end in _SHDN_SEG4; ports SHDN_IN=SHDN_IN4 SHDN_OUT=SHDN_IN5 STATE_INIT_LATCH=SHDN_SEG_LATCH STATE_SENSE=STATE_SENSE4 STATE_TRIGGER=STATE_TRIGGER4
SHDN_LOOP/SHDN_SEG5: designators end in _SHDN_SEG5; ports SHDN_IN=SHDN_IN5 SHDN_OUT=SHDN_IN6 STATE_INIT_LATCH=SHDN_SEG_LATCH STATE_SENSE=STATE_SENSE5 STATE_TRIGGER=STATE_TRIGGER5
SHDN_LOOP/SHDN_SEG6: designators end in _SHDN_SEG6; ports SHDN_IN=SHDN_IN6 SHDN_OUT=SHDN_OUT6 STATE_INIT_LATCH=SHDN_SEG_LATCH STATE_SENSE=STATE_SENSE6 STATE_TRIGGER=STATE_TRIGGER6

### Notes on the sheet
- (near P4) Jumper to bypass state holding / locking for testing and depreciation
- SSR for initial state setting & isolation
- (near Q2) MOSFET for triggering SSR
- Diode for flyback current
- State Indicating LED
  Will also act as a tiny load on the shutdown line
- SSR
- Relay
- https://datasheet.octopart.com/AQY212EHA-Panasonic-datasheet-109895.pdf
- https://lcsc.com/product-detail/Relays_OMRON_G6S-2-12V_G6S-2-12V_C28410.html
- Relay Diode
- Any of these part numbers are suitable replacements to the one listed in the same product family
  - AQY211EH AQY211EHA AQY211EHAX AQY211EHAZ
  - AQY212EH AQY212EHA AQY212EHAX AQY212EHAZ
- https://lcsc.com/product-detail/Diodes-General-Purpose_ON-Semicon_MURA120T3G_ON-Semicon-ON-MURA120T3G_C111832.html
- Any diode that has 500mA and greater than 20V resistance will be fine. The package is a common SMA type
- Title
- Size:
- Date:
- A4
- Number:
- Time:
- Revision:
- Sheet
- of
- File:
- (in symbol TestPoint_SMD) SMD

### Library data of the parts
D38 = CMP-2000-04942-2: General Purpose Rectifier, 1 A, 1000 V, -55 to 150 degC, 2-Pin DO-214AC, RoHS, Tape and Reel; Manufacturer: Fairchild; Repetitive Reverse Voltage Vrrm Max: 1kV; Reel Quantity: 7500; Forward Voltage: 1V; No. of Pins: 2; External Depth: 2.79mm; Current Ifsm: 30A; Diode Configuration: Single; Reverse Recovery Time trr Max: 1.8µs; Diode Type: StandardRecovery; External Width: 5.28mm; SVHC: NoSVHC(19-Dec-2012); External Length / Height: 2.44mm; Diode Polarity: Cathode; Current If @ Vf: 1A; SMD Marking: 1M; Tape Width: 12mm; Datasheet URL: https://datasheet.ciiva.com/4452/s1m-191340-4452980.pdf; Alternate Case Style: DO-214AC; Package Reference: DO-214AC-2; Diode Case Style: DO-214AC; Package / Case: SMA; Junction Temperature Tj Max: 150degC; Operating Temperature Range: -55degCto+150degC; Operating Temperature Min: -55degC; Datasheet Version: Rev. 1.1.2, 10/2013; Manufacturer URL: https://www.fairchildsemi.com/; Termination Type: SMD; Forward Surge Current Ifsm Max: 30A; Operating Temperature Max: 150degC; Package Description: 2-Pin Surface Mount Device, Body 4.375 x 2.725 mm; Package URL: https://www.fairchildsemi.com/package-drawings/DO/DO214AC.pdf; Reverse Recovery Time trr Typ: 1.8µs; Forward Voltage VF Max: 1V; Forward Current If(AV): 1A
J1 = G6S-2-DC12: Telecom Non Latching 12VDC DPDT 2A Through Hole Relays RoHS; ComponentLink1Description: LCSC; ComponentLink1URL: https://lcsc.com/product-detail/Relays_OMRON_G6S-2-12V_G6S-2-12V_C28410.html
K2 = CMP-1346-00006-1: PhotoMOS GE 1 Form A, 60 V Load Voltage, 0.55 A Continuous Load Current, -40 to 85 degC, 4-Pin DIP(SMT), Tube, RoHS; Manufacturer: Panasonic; Continuous Load Current: 0.55 A; Load Voltage: 60 V; On Resistance (Typ): 0.85 Ohm; Pb-Free: True; ComponentLink2Description: Datasheet; PackageVersion: ASCTB67E, 04/2014; DatasheetVersion: 201404-T; Packing: Tube; ComponentLink1URL: http://www3.panasonic.biz/ac/ae/index.jsp; PackageReference: DIP4(SMT); Series: PhotoMOS GE 1 Form A; RoHS: True; ComponentLink1Description: Manufacturer URL; ComponentLink3Description: Package Specification; PartNumber: AQY212EHA; PackageDescription: 4-Pin Surface Mount Terminal Package, Body 4.78 x 6.4 mm, Pitch 2.54mm; ComponentLink2URL: http://www3.panasonic.biz/ac/e_download/control/relay/photomos/catalog/semi_eng_ge1a_aqy21_e.pdf; ComponentLink3URL: http://www3.panasonic.biz/ac/e_download/control/relay/photomos/catalog/semi_eng_dimensions.pdf?f_cd=401560; Mounting Technology: Surface Mount
P4 = Header 2: Header, 2-Pin; LatestRevisionDate: 17-Jul-2002; LatestRevisionNote: Re-released for DXP Platform.; Publisher: Altium Limited
Q2 = CMP-1058-00774-1: Power MOSFET, 60 V, 155 mOhm, Single N-Channel Logic Level, 3-Pin SOT-23, Pb-Free, Tape and Reel; Manufacturer: On Semiconductor; Ciss Typ (pF): 182; Coss Typ (pF): 25; ID Max (A): 2.2; Crss Typ (pF): 16; V(BR)DSS Min (V): 60; Qrr Typ (nC): 6; VGS Max (V): 20; VGS(th) Max (V): 2.5; Channel Polarity: N Channel; Package Type: SOT-23-3; ComponentLink1URL: http://www.onsemi.com/; ComponentLink2Description: Datasheet; ComponentLink1Description: Manufacturer URL; Mounting Technology: Surface Mount; Configuration: Single; Packing: Tape and Reel; RoHS: Pb-Free; ComponentLink3URL: http://www.onsemi.cn/pub_link/Collateral/318-08.PDF; PackageVersion: Rev. AP, 11/2009; PackageReference: SOT-23-3-318-08; DatasheetVersion: Rev. 1; PackageDescription: 3-Pin Small Outline Transistor, Body 2.92 x 1.3 mm, Pitch 0.95 mm; ComponentLink3Description: Package Specification; ComponentLink2URL: http://www.onsemi.com/pub_link/Collateral/NVR5198NL-D.PDF; PartNumber: NVR5198NLT1G
R66 = CMP-1012-00074-1: 1K 0.1W 5% 0603 (1608 Metric)  SMD; Case-EIA: 0603; Case-Metric: 1608; Value: 1000.00 Ohm; Technology: SMT; Tolerance: 5 %; Power: 0.1 W

## Sheet MCU.SchDoc: QUTMS Shutdown V2 - MCU
size A4; Author: Jonn Dillon; Organization: QUT Motorsport; Address1: O-120; Address2: O Block; Address3: QUT Gardens Point; Address4: Brisbane, 4000; DocumentNumber: 8; SheetNumber: 8; SheetTotal: 10
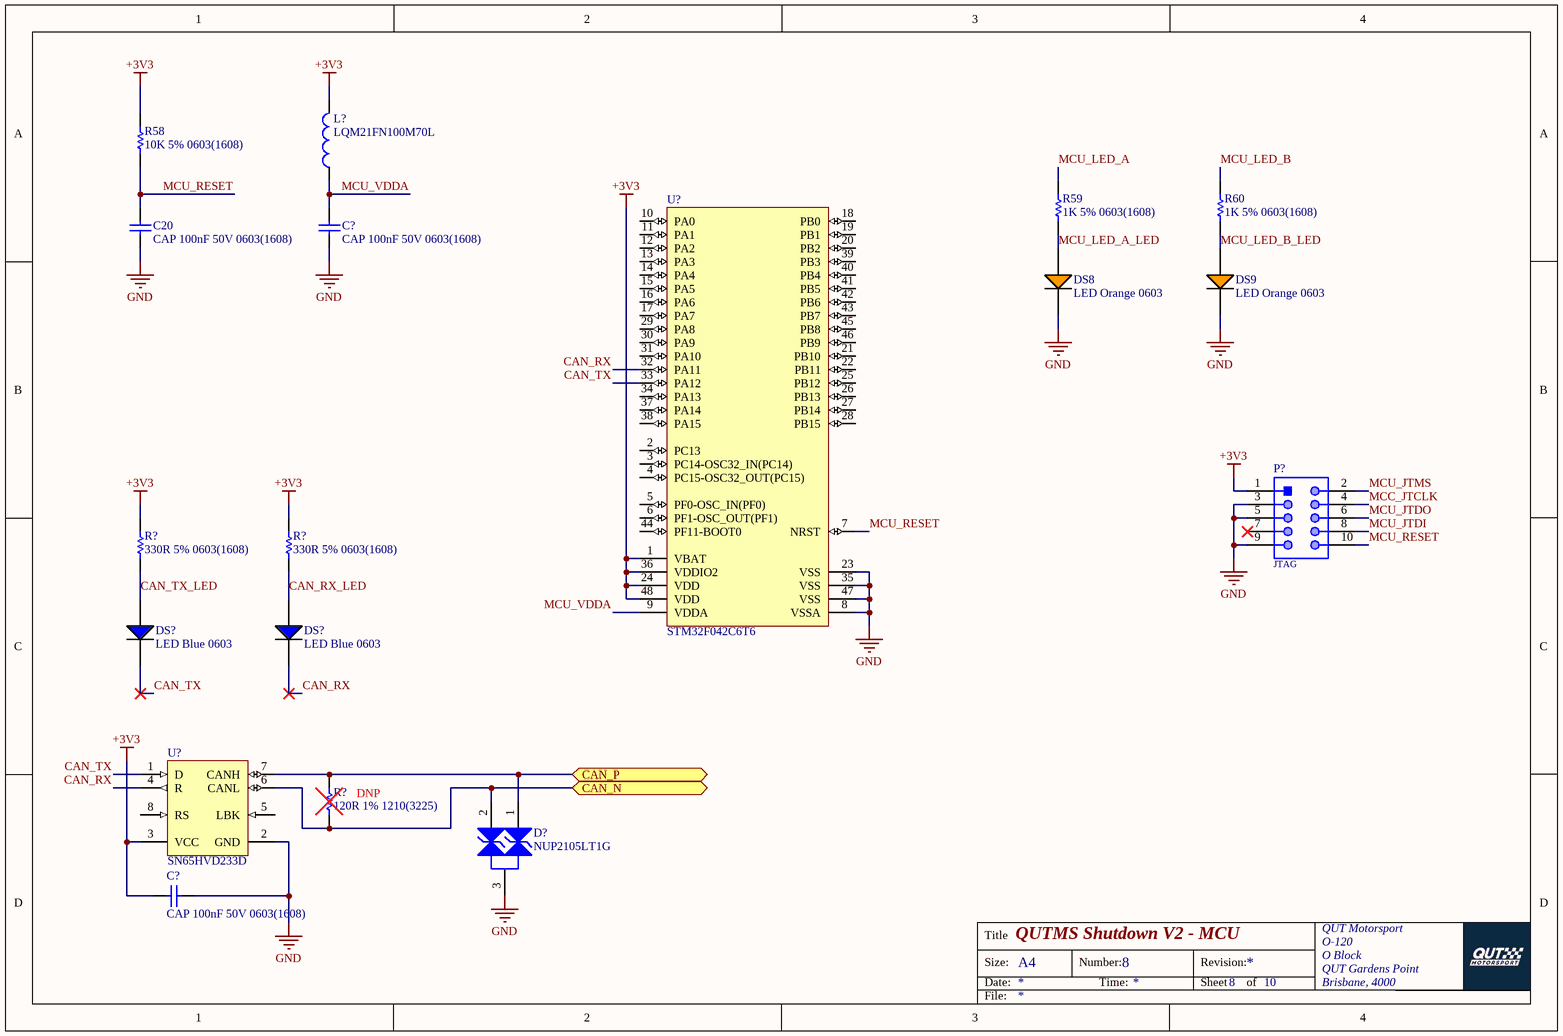
[diagram p5: MCU.SchDoc]

### Parts
(Parts that share a designator on the sheet are numbered #1, #2 ... from top to bottom, then left to right.)
C20  CAP 100nF 50V 0603(1608)  [CAPC0603(1608)100_L]
C?#1  CAP 100nF 50V 0603(1608)  [CAPC0603(1608)100_L]
C?#2  CAP 100nF 50V 0603(1608)  [CAPC0603(1608)100_L]
D?  NUP2105LT1G  [ONSC-SOT-23-3-318-08_V]
DS8  LED Orange 0603  [LED ORANGE 0603]
DS9  LED Orange 0603  [LED ORANGE 0603]
DS?#1  LED Blue 0603  [LED BLUE 0603]
DS?#2  LED Blue 0603  [LED BLUE 0603]
L?  LQM21FN100M70L  [MURA-IND0805_L]
P?  JTAG  [61301021121]
R58  10K 5% 0603(1608)  [RESC0603(1608)_N]
R59  1K 5% 0603(1608)  [RESC0603(1608)_L]
R60  1K 5% 0603(1608)  [RESC0603(1608)_L]
R?#1  330R 5% 0603(1608)  [RESC0603(1608)_L]
R?#2  330R 5% 0603(1608)  [RESC0603(1608)_L]
R?#3  120R 1% 1210(3225)  [RESC1210(3225)_M]
U?#1  STM32F042C6T6  [STM-LQFP48_M]
U?#2  SN65HVD233D  [D0008A_N]

### Ports
CAN_N (bidir), CAN_P (bidir)

### Nets
+3V3: C?#2.1 L?.2 P?.1 R58.2 R?#1.2 R?#2.2 U?#1.1(VBAT) U?#1.24(VDD) U?#1.36(VDDIO2) U?#1.48(VDD) U?#2.3(VCC)
GND: C20.2 C?#1.2 C?#2.2 D?.3(K) DS8.2(C) DS9.2(C) P?.3 P?.5 P?.9 U?#1.8(VSSA) U?#1.23(VSS) U?#1.35(VSS) U?#1.47(VSS) U?#2.2(GND)
CAN_N: D?.2(K) R?#3.1 U?#2.6(CANL) ; port CAN_N
CAN_P: D?.1(K) R?#3.2 U?#2.7(CANH) ; port CAN_P
CAN_RX: DS?#2.2(C) U?#1.32(PA11) U?#2.4(R)
CAN_RX_LED: DS?#2.1(A) R?#2.1
CAN_TX: DS?#1.2(C) U?#1.33(PA12) U?#2.1(D)
CAN_TX_LED: DS?#1.1(A) R?#1.1
MCC_JTCLK: P?.4
MCU_JTDI: P?.8
MCU_JTDO: P?.6
MCU_JTMS: P?.2
MCU_LED_A: R59.2
MCU_LED_A_LED: DS8.1(A) R59.1
MCU_LED_B: R60.2
MCU_LED_B_LED: DS9.1(A) R60.1
MCU_RESET: C20.1 P?.10 R58.1 U?#1.7(NRST)
MCU_VDDA: C?#1.1 L?.1 U?#1.9(VDDA)

Not connected (* = marked no-connect by the designer): P? 7*; U?#1 2(PC13) 3(PC14-OSC32_IN(PC14)) 4(PC15-OSC32_OUT(PC15)) 5(PF0-OSC_IN(PF0)) 6(PF1-OSC_OUT(PF1)) 10(PA0) 11(PA1) 12(PA2) 13(PA3) 14(PA4) 15(PA5) 16(PA6) 17(PA7) 18(PB0) 19(PB1) 20(PB2) 21(PB10) 22(PB11) 25(PB12) 26(PB13) 27(PB14) 28(PB15) 29(PA8) 30(PA9) 31(PA10) 34(PA13) 37(PA14) 38(PA15) 39(PB3) 40(PB4) 41(PB5) 42(PB6) 43(PB7) 44(PF11-BOOT0) 45(PB8) 46(PB9); U?#2 5(LBK) 8(RS)

### Notes on the sheet
- (near R?#3) DNP
- Title
- Size:
- Date:
- A4
- Number:
- Time:
- Revision:
- Sheet
- of
- File:

### Library data of the parts
C20 C?#1 C?#2 = CMP-1035-02591-1: as C17 on sheet Demux; Rated Voltage: 50 V; Max Thickness: 1 mm; Technology: SMT; Value: 100nF
D? = CMP-1063-00164-1: Dual Line CAN Bus Protector, 3-Pin SOT-23, Pb-Free, Tape and Reel; Manufacturer: On Semiconductor; IR Max (uA): 0.1; Number of Lines: 2; Direction: Bidirectional; C Max (pF): 30; PPK Max (W): 350; V(BR) Min (V): 26.2; ComponentLink3URL: http://www.onsemi.cn/pub_link/Collateral/318-08.PDF; Mounting Technology: Surface Mount; ComponentLink2Description: Datasheet; PartNumber: NUP2105LT1G; ComponentLink1URL: http://www.onsemi.com/; PackageVersion: Rev. AP, 11/2009; DatasheetVersion: Rev. 5; RoHS: Pb-Free; PackageReference: SOT-23-3-318-08; ComponentLink2URL: http://www.onsemi.cn/pub_link/Collateral/NUP2105L-D.PDF; ComponentLink1Description: Manufacturer URL; PackageDescription: 3-Pin Small Outline Transistor, Body 2.92 x 1.3 mm, Pitch 0.95 mm; Packing: Tape and Reel; ComponentLink3Description: Package Specification
L? = CMP-2000-06587-1: Fixed Inductor, 10 uH, +/-20%, -55 to 125 degC, 2-Pin SMD (0805), RoHS, Tape and Reel; Manufacturer: Murata; Tolerance (%): 20%; DC Resistance: 0.6; Inductance-Nom: 10H; Rated Current-Max: 100mA; Package Reference: IND0805; Case Size/Dimension: 0805; Manufacturer URL: http://www.murata.com/; Package Description: 2-Pin Surface Mount Device, Body 2 x 1.25 mm; Datasheet URL: http://psearch.en.murata.com/inductor/product/LQM21FN100M70%23.pdf; Mounting Technology: SurfaceMount; Datasheet Version: 05/2016
P? = CMP-1502-01084-1: THT Vertical Pin Header WR-PHD, Pitch 2.54 mm, Dual Row, 10 pins; Manufacturer: Wurth Elektronik; Working Voltage: 250VAC; Pitch: 2.54mm; Contact Resistance: 20mOhm; Gender: Male; Rated Current: 3A; Withstanding Voltage: 500VAC; Pin Number: 10; Operating Temperature: -40to105degC; Mounting Technology: THT; Publisher: WurthElektronik; Manufacturer URL: http://www.we-online.de; Part Number: 61301021121; Row Number: Dual; Packaging: Bag; Orientation: Vertical; Package Reference: 61301021121; Datasheet URL: https://katalog.we-online.de/em/datasheet/6130xx21121.pdf
R58 = CMP-1012-00098-1: as R32 on sheet Demux; Technology: SMT; Tolerance: 5 %; Power: 0.1 W
R59 R60 = CMP-1012-00074-1: as R66 on sheet ShutdownSegement; Technology: SMT; Tolerance: 5 %; Power: 0.1 W
R?#1 R?#2 = CMP-1012-00062-1: 330R 0.1W 5% 0603 (1608 Metric)  SMD; Value: 330.00 Ohm; Case-EIA: 0603; Case-Metric: 1608; Tolerance: 5 %; Power: 0.1 W; Technology: SMT
R?#3 = CMP-1015-00405-1: 120R 0.5W 1% 1210 (3225 Metric)  SMD; Case-Metric: 3225; Value: 120.00 Ohm; Case-EIA: 1210; Technology: SMT; Tolerance: 1 %; Power: 0.5 W
U?#1 = CMP-0304-00103-2: ARM Cortex-M0 32-bit MCU, 32 KB Flash, 6 KB Internal RAM, 38 I/Os, 48-Pin LQFP, -40 to 85 degC, Tray; Manufacturer: STMicroelectronics; Operating Frequency(F) (Processor speed) (MHz): 48; FLASH Size (Prog) (kB): 32; Internal RAM Size (kB): 6; I/Os (High Current): 38; Supply Voltage(Vcc) min (V): 2; ComponentLink1URL: http://www.st.com/; Packing: Tray; Package Description: 48-Pin Low Profile Quad Flat Package, Body 7 x 7 mm, Pitch 0.5 mm; ComponentLink2URL: http://www.st.com/st-web-ui/static/active/en/resource/technical/document/datasheet/DM00105814.pdf; ComponentLink2Description: Datasheet; ComponentLink1Description: Manufacturer URL; Mounting Technology: Surface Mount; Core: ARM Cortex-M0; Package Reference: LQFP48; PartNumber: STM32F042C6T6; DatasheetVersion: Rev. 5
U?#2 = CMP-0315-00036-2: 3.3V CAN Transceiver with Standby Mode, Loop-back, 6 mA, -40 to 125 degC, 8-pin SOIC (D), Green (RoHS & no Sb/Br); Manufacturer: Texas Instruments; Receivers Per Package: 1; Bus Fault Voltage(V): +/-30; Rating: Catalog; ICC(Max)(mA): 6; Supply Voltage(s)(V): 3.3; Transient Pulse Protection(V): -100 to 100; PackageVersion: revM, Jun-2011; PackageReference: D0008A; ComponentLink1Description: Datasheet; Isolated: No; Footprint: PCA82C250, excludes pin5; DatasheetVersion: SLLS557F; PackageDescription: 8-Pin Plastic Small Outline Integrated Circuit, 4.9 x 3.9 mm, Pitch 1.27 mm Pitch; Features: Loop Back; Low Power Mode: Standby; SubFamily: CAN; Drivers Per Package: 1; Eco-Plan: Green (RoHS & no Sb/Br); ComponentLink1URL: http://www.ti.com/general/docs/lit/getliterature.tsp?genericPartNumber=SN65HVD233&fileType=pdf; PartNumber: SN65HVD233D; Code_JEDEC: MS-012AA; Mounting Technology: Surface Mount

## Sheet Power.SchDoc: QUTMS Shutdown V2 - Power
size A4; Author: Jonn Dillon; Organization: QUT Motorsport; Address1: O-120; Address2: O Block; Address3: QUT Gardens Point; Address4: Brisbane, 4000; DocumentNumber: 9; SheetNumber: 9; SheetTotal: 10
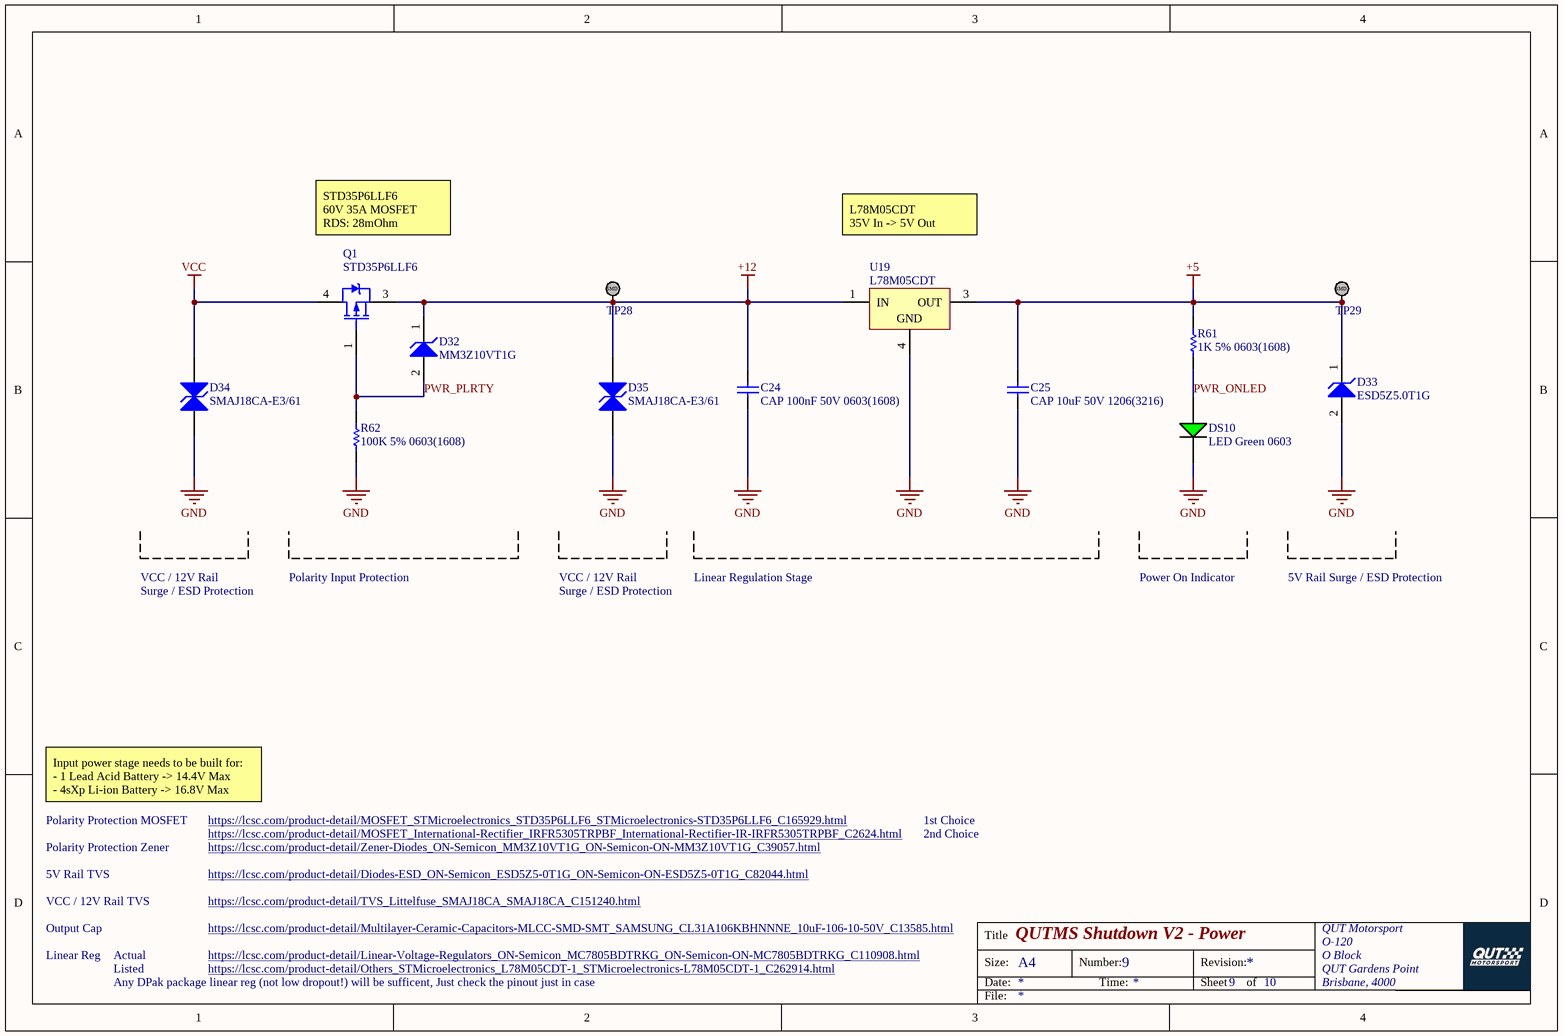
[diagram p6: Power.SchDoc]

### Parts
C24  CAP 100nF 50V 0603(1608)  [CAPC0603(1608)100_N]
C25  CAP 10uF 50V 1206(3216)  [CAPC1206(3216)190_N]
D32  MM3Z10VT1G  [ONSC-SOD-323-2-477-02_V]
D33  ESD5Z5.0T1G  [ONSC-SOD-523-2-502-01_V]
D34  SMAJ18CA-E3/61  [VISH-DO-214AC-2_N]
D35  SMAJ18CA-E3/61  [VISH-DO-214AC-2_N]
DS10  LED Green 0603  [LED GREEN 0603]
Q1  STD35P6LLF6  [ONSC-DPAK-3-369C-01_V]
R61  1K 5% 0603(1608)  [RESC0603(1608)_N]
R62  100K 5% 0603(1608)  [RESC0603(1608)_N]
TP28  TestPoint_SMD  [TestPointSMD]  (value not drawn)
TP29  TestPoint_SMD  [TestPointSMD]  (value not drawn)
U19  L78M05CDT  [STM-TO252-3_A_V]

### Nets
+5: C25.2 D33.1(K) R61.2 TP29.1 U19.3(OUT)
+12: C24.2 D32.1(K) D35.2(A2) Q1.3(S) TP28.1 U19.1(IN)
GND: C24.1 C25.1 D33.2(A) D34.1(A1) D35.1(A1) DS10.2(C) R62.1 U19.4(GND)
VCC: D34.2(A2) Q1.4(D)
PWR_ONLED: DS10.1(A) R61.1
PWR_PLRTY: D32.2(A) Q1.1(G) R62.2

### Notes on the sheet
- STD35P6LLF6
  60V 35A MOSFET
  RDS: 28mOhm
- L78M05CDT
  35V In -> 5V Out
- VCC / 12V Rail
- Polarity Input Protection
- Linear Regulation Stage
- Power On Indicator
- 5V Rail Surge / ESD Protection
- Surge / ESD Protection
- Polarity Protection MOSFET
- Polarity Protection Zener
- Input power stage needs to be built for:
  - 1 Lead Acid Battery -> 14.4V Max
  - 4sXp Li-ion Battery -> 16.8V Max
- https://lcsc.com/product-detail/MOSFET_International-Rectifier_IRFR5305TRPBF_International-Rectifier-IR-IRFR5305TRPBF_C2624.html
- https://lcsc.com/product-detail/Zener-Diodes_ON-Semicon_MM3Z10VT1G_ON-Semicon-ON-MM3Z10VT1G_C39057.html
- https://lcsc.com/product-detail/MOSFET_STMicroelectronics_STD35P6LLF6_STMicroelectronics-STD35P6LLF6_C165929.html
- 1st Choice
- 2nd Choice
- 5V Rail TVS
- VCC / 12V Rail TVS
- https://lcsc.com/product-detail/Diodes-ESD_ON-Semicon_ESD5Z5-0T1G_ON-Semicon-ON-ESD5Z5-0T1G_C82044.html
- https://lcsc.com/product-detail/TVS_Littelfuse_SMAJ18CA_SMAJ18CA_C151240.html
- Linear Reg
- Output Cap
- Actual
- Listed
- Any DPak package linear reg (not low dropout!) will be sufficent, Just check the pinout just in case
- https://lcsc.com/product-detail/Multilayer-Ceramic-Capacitors-MLCC-SMD-SMT_SAMSUNG_CL31A106KBHNNNE_10uF-106-10-50V_C13585.html
- https://lcsc.com/product-detail/Linear-Voltage-Regulators_ON-Semicon_MC7805BDTRKG_ON-Semicon-ON-MC7805BDTRKG_C110908.html
- https://lcsc.com/product-detail/Others_STMicroelectronics_L78M05CDT-1_STMicroelectronics-L78M05CDT-1_C262914.html
- Title
- Size:
- Date:
- A4
- Number:
- Time:
- Revision:
- Sheet
- of
- File:
- (in symbol TestPoint_SMD) SMD

### Library data of the parts
C24 = CMP-1035-02591-1: as C17 on sheet Demux; Rated Voltage: 50 V; Max Thickness: 1 mm; Technology: SMT; Value: 100nF
C25 = CMP-1037-04982-1: as C26 on sheet ShutdownLoop; Technology: SMT; Max Thickness: 1.9 mm; Value: 10uF; Rated Voltage: 50 V
D32 = CMP-1060-00715-1: Zener Voltage Regulator, 300 mW, 2-Pin SOD-323, Pb-Free, Tape and Reel; Manufacturer: On Semiconductor; VZ Typ (V): 10; P Max (W): 0.3; ComponentLink1Description: Manufacturer URL; DatasheetVersion: Rev. 9; PartNumber: MM3Z10VT1G; PackageDescription: 2-Pin SOD, Body 1.7 x 1.25 mm; Packing: Tape and Reel; ComponentLink1URL: http://www.onsemi.com/; PackageReference: SOD-323-2-477-02; PackageVersion: Rev. H, 03/2007; ComponentLink3URL: http://www.onsemi.com/pub_link/Collateral/477-02.PDF.1; Mounting Technology: Surface Mount; RoHS: Pb-Free; ComponentLink2URL: http://www.onsemi.cn/pub_link/Collateral/MM3Z2V4T1-D.PDF; ComponentLink3Description: Package Specification; ComponentLink2Description: Datasheet
D33 = CMP-1063-00102-1: Transient Voltage Suppressor, Micro-Packaged Diode for ESD Protection, 2-Pin SOD-523, Pb-Free, Tape and Reel; Manufacturer: On Semiconductor; V(BR) Min (V): 6.2; VRWM Max (V): 5; Number of Lines: 1; PPK Max (W): 174; IR Max (uA): 0.05; Direction: Unidirectional; PackageVersion: Rev. E, 09/2010; Mounting Technology: Surface Mount; Packing: Tape and Reel; ComponentLink2URL: http://www.onsemi.cn/pub_link/Collateral/ESD5Z2.5T1-D.PDF; ComponentLink2Description: Datasheet; PackageReference: SOD-523-2-502-01; ComponentLink1Description: Manufacturer URL; ComponentLink3URL: http://www.onsemi.com/pub_link/Collateral/502-01.PDF; PackageDescription: 2-Pin SOD, Body 1.2 x 0.8 mm; ComponentLink3Description: Package Specification; ComponentLink1URL: http://www.onsemi.com/; RoHS: Pb-Free; PartNumber: ESD5Z5.0T1G; DatasheetVersion: Rev. 10
D34 D35 = CMP-0548-00180-2: Transient Voltage Suppressor, 6.40 to 231 V, 18 V Stand-off Voltage, Bi-Directional, -55 to 155 degC, 2-pin DO-214AC, Pb-Free, Tape and Reel; Manufacturer: Vishay Semiconductor; VWM (V): 18; IFSM: 40 A; VBR Bi-Directional (V): 6.4 to 231; ID (uA): 2; PPPM (W): 400, 300; PackageDescription: 2-Pin DO-214AC (SMA), Body 4.245 x 2.665 mm; ComponentLink1Description: Manufacturer URL; RoHS: TRUE; ComponentLink3Description: Package Specification; ComponentLink3URL: http://www.vishay.com/docs/88390/smaj50a.pdf; Mounting Technology: Surface Mount; DatasheetVersion: 12/8/2013; ComponentLink1URL: http://www.vishay.com/; ComponentLink2URL: http://www.vishay.com/docs/88390/smaj50a.pdf; PackageReference: DO-214AC-2; ComponentLink2Description: Datasheet; PartNumber: SMAJ18CA-E3/61; Packing: Tape and Reel; Operating Junction and Storage Temperature Range: -55 to 150 degC
Q1 = CMP-1058-00390-1: Power MOSFET, -60 V, -12 A, P-Channel, 3-Pin DPAK, Pb-Free, Tape and Reel; Manufacturer: On Semiconductor; PartNumber: NTD2955T4G; V(BR)DSS Min (V): 60; Qrr Typ (nC): 100; Coss Typ (pF): 150; Crss Typ (pF): 50; PD Max (W): 55; ID Max (A): 12; Channel Polarity: P Channel; Configuration: Single; VGS Max (V): 20; VGS(th) Max (V): 4; Ciss Typ (pF): 500; ComponentLink1URL: http://www.onsemi.com/; DatasheetVersion: Rev. 13; Packing: Tape and Reel; PackageVersion: Rev. E, 02/2014; Mounting Technology: Surface Mount; ComponentLink3Description: Package Specification; Package Type: DPAK-3, IPAK-4; ComponentLink3URL: http://www.onsemi.cn/pub_link/Collateral/369C.PDF; RoHS: Pb-Free; ComponentLink2URL: http://www.onsemi.cn/pub_link/Collateral/NTD2955-D.PDF; ComponentLink2Description: Datasheet; PackageReference: DPAK-3-369C-01; PackageDescription: 3-Pin Flange Mount, Body 6.54 x 6.095 mm, Pitch 2.29 mm; ComponentLink1Description: Manufacturer URL
R61 = CMP-1012-00074-1: as R66 on sheet ShutdownSegement; Technology: SMT; Tolerance: 5 %; Power: 0.1 W
R62 = CMP-1012-00122-1: 100K 0.1W 5% 0603 (1608 Metric)  SMD; Case-EIA: 0603; Value: 100000.00 Ohm; Case-Metric: 1608; Tolerance: 5 %; Power: 0.1 W; Technology: SMT
U19 = CMP-2000-06530-1: Precision Regulator, 0.5 A, 5 V Output, 0 to 150 degC, 3-Pin DPAK (TO252), RoHS, Tube; Manufacturer: STMicroelectronics; No. of Pins: 3Pins; SVHC: NoSVHC(17-Dec-2015); Input Voltage Max: 35V; Linear Regulator Case Style: TO-252; Output Voltage Nom.: 5V; Output Current: 500mA; Input Voltage Min: 10V; Manufacturer URL: http://www.st.com/; Operating Temperature Min: 0°C; Package Description: 3-Pin Transistor Outline, Body 6.5 x 6.1 mm, Pitch 2.28 mm; Package Reference: TO252; Datasheet Version: Rev. 20, 06/2014; Packaging: Each; Mounting Technology: SurfaceMount; Operating Temperature Max: 150°C; Datasheet URL: http://www.st.com/content/ccc/resource/technical/document/datasheet/d7/5f/dc/5c/d5/b6/48/7c/CD00000447.pdf/files/CD00000447.pdf/jcr:content/translations/en.CD00000447.pdf

## Sheet 12VInputProtection.SchDoc
size A4
Used 6 times, as channels SHDN_RESET_PROTECTION, SHDN_RESET_PROTECTION, SHDN_RESET_PROTECTION, SHDN_RESET_PROTECTION, SHDN_RESET_PROTECTION, SHDN_RESET_PROTECTION. Parts and nets are listed once, with the designators drawn on the sheet.
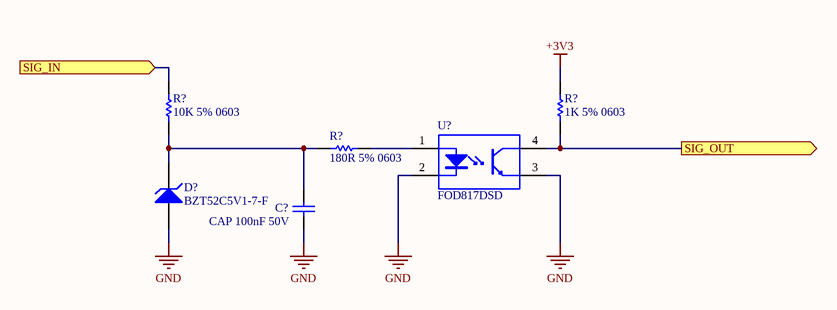
[diagram p7: 12VInputProtection.SchDoc]

### Parts
(Parts that share a designator on the sheet are numbered #1, #2 ... from top to bottom, then left to right.)
C?  CAP 100nF 50V  [CAPC0603(1608)100_L]
D?  BZT52C5V1-7-F  [DIOD-SOD123_V]
R?#1  10K 5% 0603  [RESC0603(1608)_N]
R?#2  1K 5% 0603  [RESC1608X55X25ML10T15]
R?#3  180R 5% 0603  [RESC1608X55X25LL10T15]
U?  FOD817DSD  [FAIR-MDIP-4_V]

### Ports
SIG_IN (in), SIG_OUT (out)

### Nets
+3V3: R?#2.2
GND: C?.2 D?.1(A) U?.2(CATHODE) U?.3(EMITTER)
SIG_IN: R?#1.1 ; port SIG_IN
SIG_OUT: R?#2.1 U?.4(COLLECTOR) ; port SIG_OUT
NetC?_1: C?.1 D?.2(K) R?#1.2 R?#3.1
NetR?#3_2: R?#3.2 U?.1(ANODE)

### Channels
SHDN_RESET_PROTECTION: designators C?=C?_SHDN_RESET_PROTECTION#1 D?=D?_SHDN_RESET_PROTECTION#1 R?=R?_SHDN_RESET_PROTECTION#1 R?=R?_SHDN_RESET_PROTECTION#3 R?=R?_SHDN_RESET_PROTECTION#2 U?=U?_SHDN_RESET_PROTECTION#1; ports SIG_IN=SHUTDOWN_RESET SIG_OUT=SHDN_SEG_LATCH
SHDN_RESET_PROTECTION: designators C?=C?_SHDN_RESET_PROTECTION#2 D?=D?_SHDN_RESET_PROTECTION#2 R?=R?_SHDN_RESET_PROTECTION#4 R?=R?_SHDN_RESET_PROTECTION#6 R?=R?_SHDN_RESET_PROTECTION#5 U?=U?_SHDN_RESET_PROTECTION#2; ports SIG_IN=HVD_IN_VCC SIG_OUT=STATE_TRIGGER1
SHDN_RESET_PROTECTION: designators C?=C?_SHDN_RESET_PROTECTION#3 D?=D?_SHDN_RESET_PROTECTION#3 R?=R?_SHDN_RESET_PROTECTION#7 R?=R?_SHDN_RESET_PROTECTION#9 R?=R?_SHDN_RESET_PROTECTION#8 U?=U?_SHDN_RESET_PROTECTION#3; ports SIG_IN=IMD_IN_VCC SIG_OUT=STATE_TRIGGER2
SHDN_RESET_PROTECTION: designators C?=C?_SHDN_RESET_PROTECTION#4 D?=D?_SHDN_RESET_PROTECTION#4 R?=R?_SHDN_RESET_PROTECTION#10 R?=R?_SHDN_RESET_PROTECTION#12 R?=R?_SHDN_RESET_PROTECTION#11 U?=U?_SHDN_RESET_PROTECTION#4; ports SIG_IN=BMS_IN_VCC SIG_OUT=STATE_TRIGGER3
SHDN_RESET_PROTECTION: designators C?=C?_SHDN_RESET_PROTECTION#5 D?=D?_SHDN_RESET_PROTECTION#5 R?=R?_SHDN_RESET_PROTECTION#13 R?=R?_SHDN_RESET_PROTECTION#15 R?=R?_SHDN_RESET_PROTECTION#14 U?=U?_SHDN_RESET_PROTECTION#5; ports SIG_IN=PDOC_IN_VCC SIG_OUT=STATE_TRIGGER4
SHDN_RESET_PROTECTION: designators C?=C?_SHDN_RESET_PROTECTION#6 D?=D?_SHDN_RESET_PROTECTION#6 R?=R?_SHDN_RESET_PROTECTION#16 R?=R?_SHDN_RESET_PROTECTION#18 R?=R?_SHDN_RESET_PROTECTION#17 U?=U?_SHDN_RESET_PROTECTION#6; ports SIG_IN=SDC_IN_VCC SIG_OUT=STATE_TRIGGER6

### Notes on the sheet
- Title
- Size:
- Date:
- A4
- Number:
- Time:
- Revision:
- Sheet
- of
- File:

### Library data of the parts
C? = CMP-1035-02591-1: as C17 on sheet Demux; Rated Voltage: 50 V; Max Thickness: 1 mm; Technology: SMT; Value: 100nF
D? = CMP-2000-05976-1: as D6 on sheet Demux; Height: 1.35mm; Width: 1.7mm; Minimum Operating Temperature: -65C; Series: BZT52C5; Package Description: 2-Pin Surface Mount Device, Body 2.7 x 1.55 mm; Length: 2.85mm; Mounting Technology: SurfaceMount; Brand: DiodesIncorporated; Factory Pack Quantity: 3000; Product Category: ZenerDiodes; RoHS: True; Manufacturer URL: http://www.diodes.com/; Termination Style: SMD/SMT; Package / Case: SOD-123; Packaging: Reel; Package Reference: SOD123; Datasheet Version: Rev. 37-2, 09/2012; Maximum Operating Temperature: +150C; Datasheet URL: http://www.diodes.com/_files/datasheets/ds18004.pdf; Mounting Style: SMD/SMT
R?#1 = CMP-1012-00098-1: as R32 on sheet Demux; Technology: SMT; Tolerance: 5 %; Power: 0.1 W
R?#2 = CMP-1659-00009-4: Chip Resistor, 1 KOhm, +/-1%, 0.1 W, -55 to 155 degC, 0603 (1608 Metric), RoHS, Tape and Reel; Manufacturer: Yageo; Voltage Rating: 50 V; ComponentLink2URL: http://www.yageo.com/documents/recent/PYu-RC_Group_51_RoHS_L_04.pdf; Max Operating Temperature: 155 degC; PackageDescription: 2-Pin Surface Mount Device, Body 1.6 x 0.8 mm; Packaging: Tape and Reel; ComponentLink3Description: Package Specification; REACH SVHC: No SVHC; Mount: Surface Mount; ComponentLink2Description: Datasheet; Length: 1.6 mm; PackageReference: 0603; Height: 0.45 mm; DatasheetVersion: Rev. 4, 02/2016; Min Operating Temperature: -55 degC; ComponentLink1Description: Manufacturer URL; Package Quantity: 200; RoHSCompliant: true; ComponentLink3URL: http://www.farnell.com/datasheets/443971.pdf; Pins: 2; Mounting Technology: Surface Mount; ComponentLink1URL: http://www.yageo.com/
R?#3 = CMP-2000-06929-1: Chip Resistor, 180 Ohm, +/- 1%, 0.1 W, -55 to 155 degC, 0603 (1608 Metric), RoHS, Tape and Reel; Manufacturer: Yageo; Voltage Rating: 50V; Power Rating: 100mW; Resistance: 180Ohms; Temperature Coefficient: 100PPM/C; Package Reference: 0603; Package Description: 2-Pin Surface Mount Device, Body 1.6 x 0.8 mm; Case Code - mm: 1608; Mounting Technology: SurfaceMount; Packaging: Reel; Tolerance: 1%; Manufacturer URL: http://www.yageo.com/; Series: RC; Operating Temperature Range: -55Cto+155C; Product: ThickFilmResistorsGeneralPurpose; Termination Style: SMD/SMT; Case Code - in: 0603; Datasheet Version: Rev. 7, 05/2017; Datasheet URL: http://www.yageo.com/documents/recent/PYu-RC_Group_51_RoHS_L_7.pdf
U? = CMP-2000-06281-1: Phototransistor Optocoupler, 4 us Rise, 3 us Fall, 5000 Vrms, -55 to 110 degC, 4-Pin MDIP, RoHS, Tape and Reel; Manufacturer: Fairchild Semiconductor; Current Transfer Ratio (Min): 300%@5mA; Rise / Fall Time (Typ): 4µs,3µs; Vce Saturation (Max): 200mV; Current Transfer Ratio (Max): 600%@5mA; Package Version: 10/2014; Current - DC Forward (If) (Max): 50mA; Online Catalog: FOD617,814,817Series; Voltage - Output (Max): 70V; Number of Channels: 1; Input Type: DC; Voltage - Forward (Vf) (Typ): 1.2V; Other Names: FOD817DSDDKR; Output Type: Transistor; Packaging: Digi-Reel®; Category: Isolators; Package / Case: 4-SMD,GullWing; Voltage - Isolation: 5000Vrms; Mounting Technology: SurfaceMount; Series: -; Mounting Type: SurfaceMount; Supplier Device Package: 4-SMD; Family: Optoisolators-Transistor,PhotovoltaicOutput; Standard Package: 1; Package Description: 4-Pin Surface Mount Device, Body 6.5 x 4.6 mm, Pitch 2.54 mm; Datasheet Version: Rev. 2.8, 11/2015; Package Reference: MDIP 4L; Manufacturer URL: https://www.fairchildsemi.com/; Current - Output / Channel: 50mA; Turn On / Turn Off Time (Typ): -; Operating Temperature: -55°C~110°C; Datasheet URL: https://www.fairchildsemi.com/datasheets/FO/FOD817D.pdf; Package URL: https://www.fairchildsemi.com/package-drawings/N0/N04C.pdf